# EAGLE schematic Retro_Lite_CM5_IO_X2.2 (EAGLE 9.6.1), part 1 of 2

## Sheet 1 of 2: Radxa CM5 Connectors
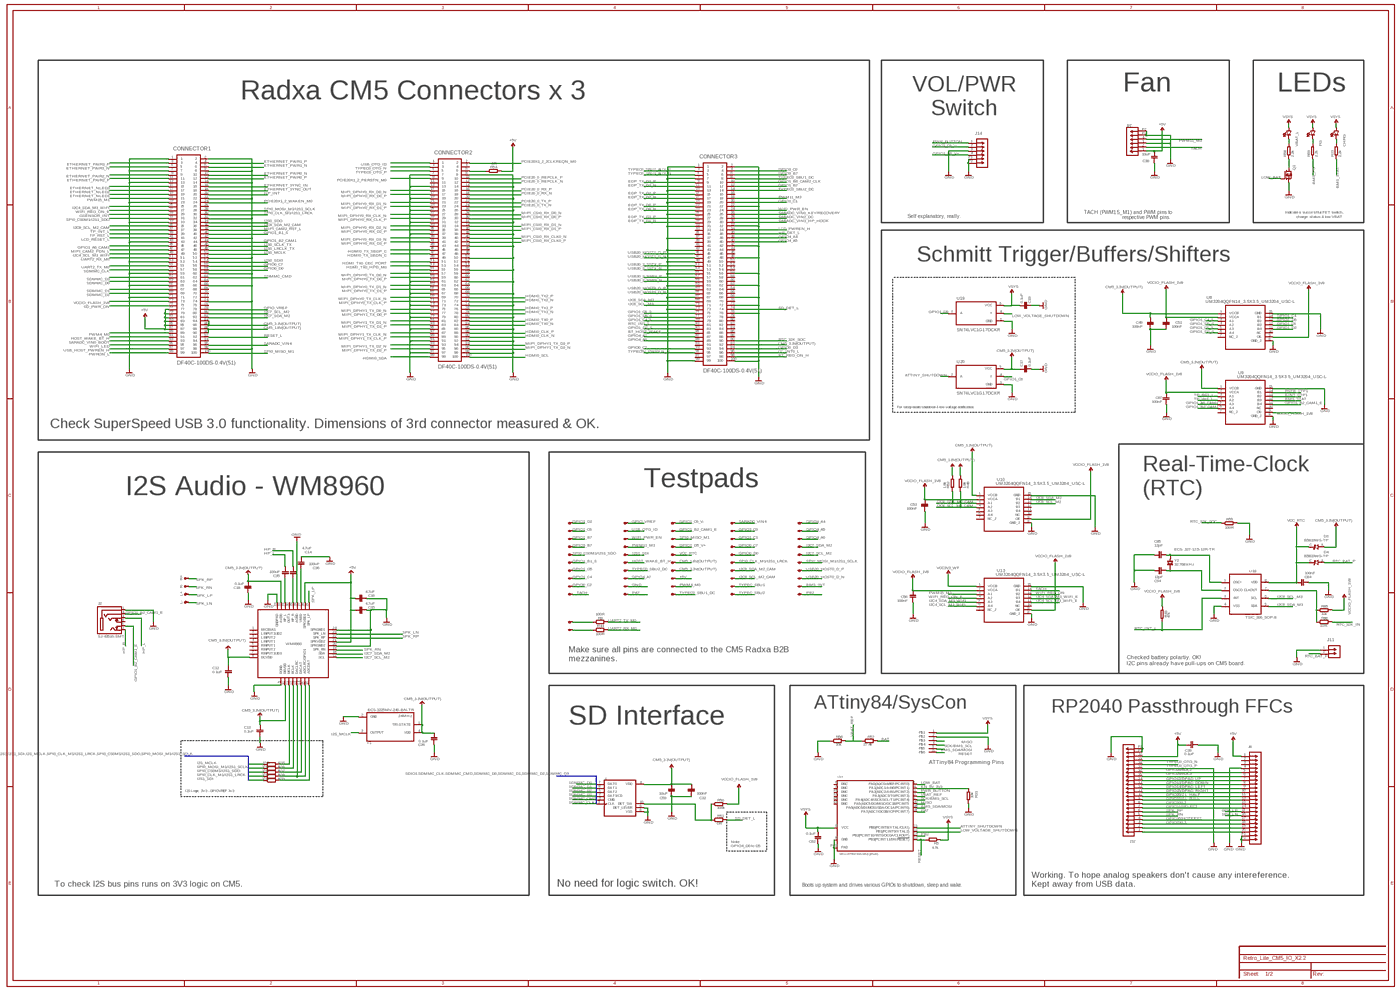
[diagram p0: schematic, sheet 1, overview]
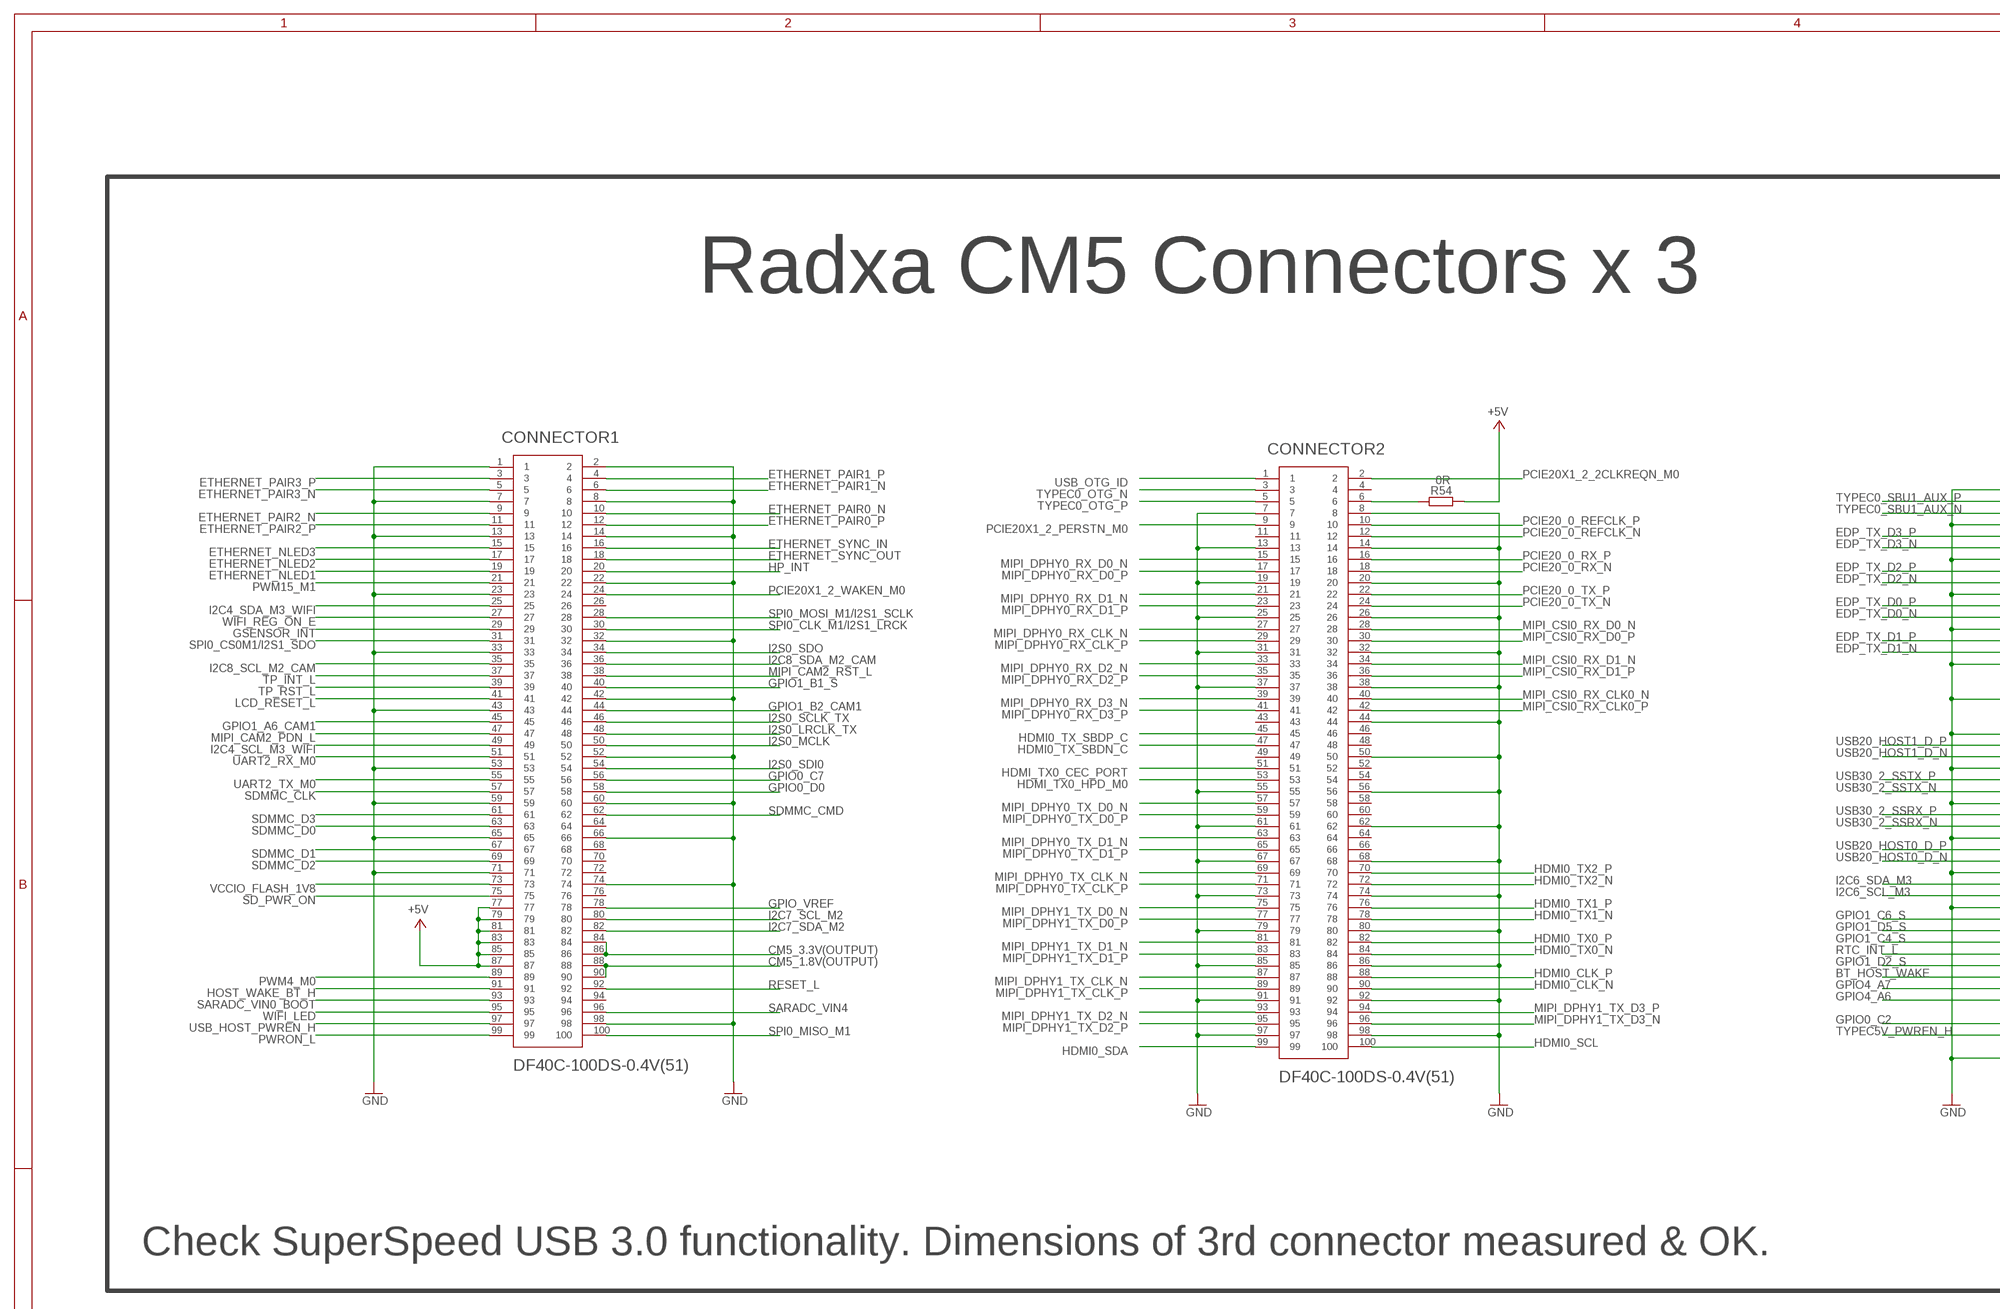
[diagram p1: schematic, sheet 1, part 1 of 4]
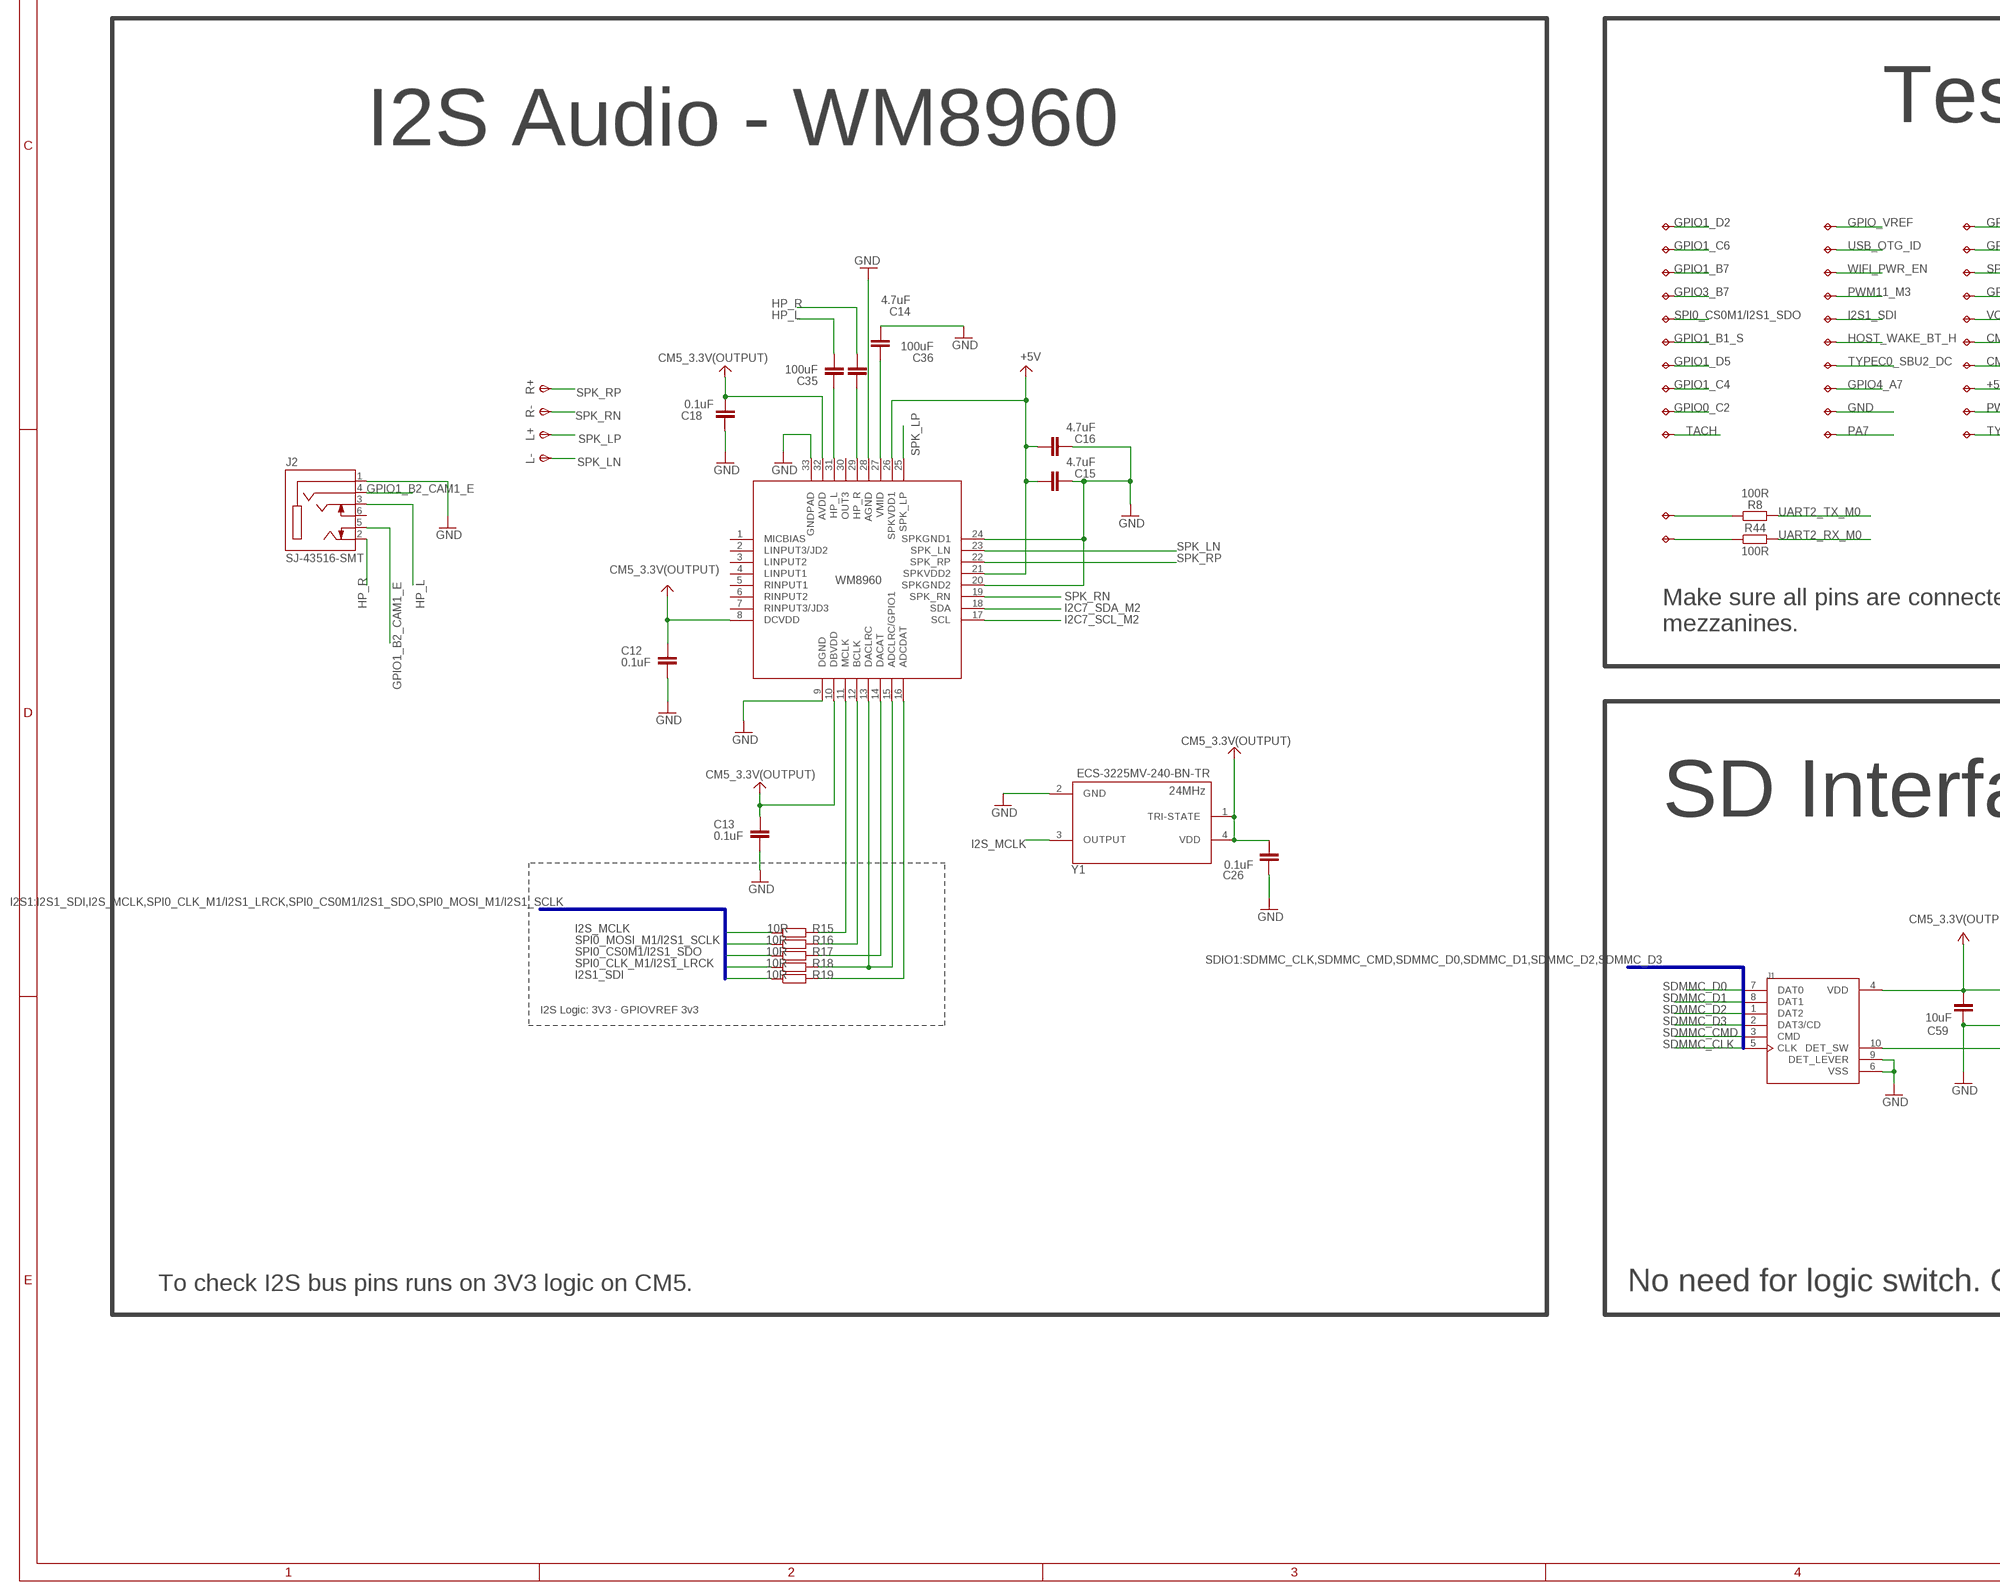
[diagram p2: schematic, sheet 1, part 2 of 4]
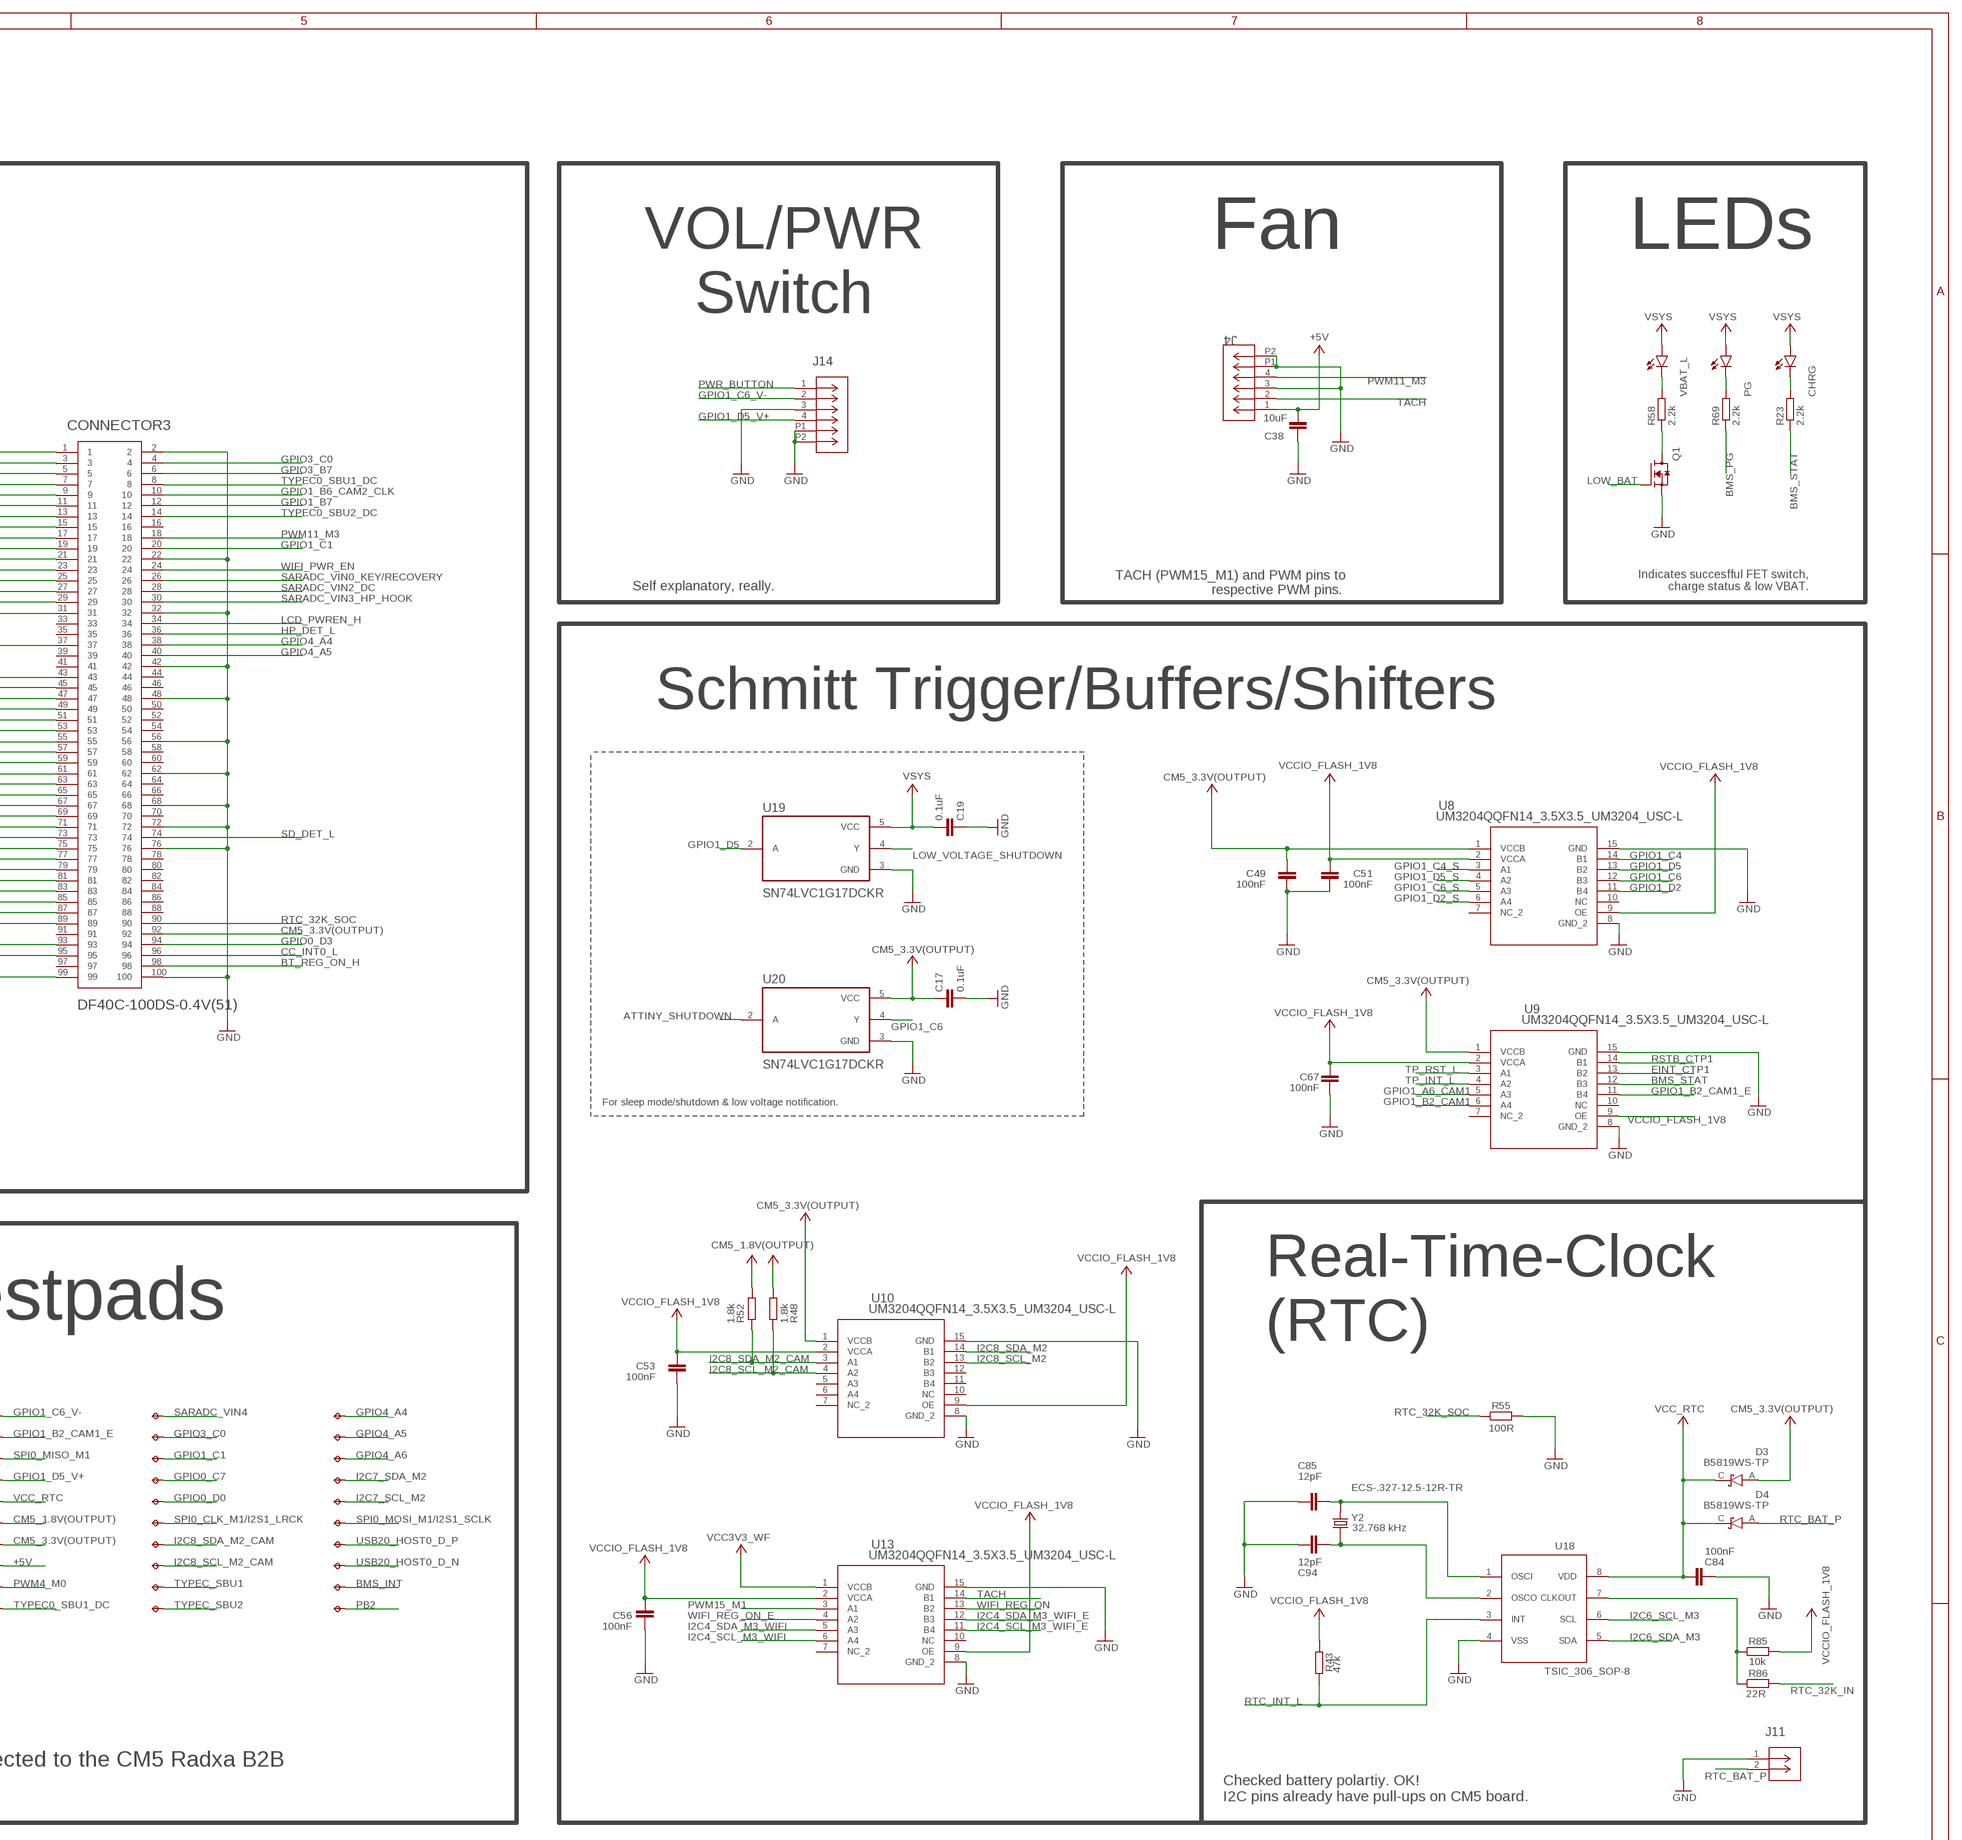
[diagram p3: schematic, sheet 1, part 3 of 4]
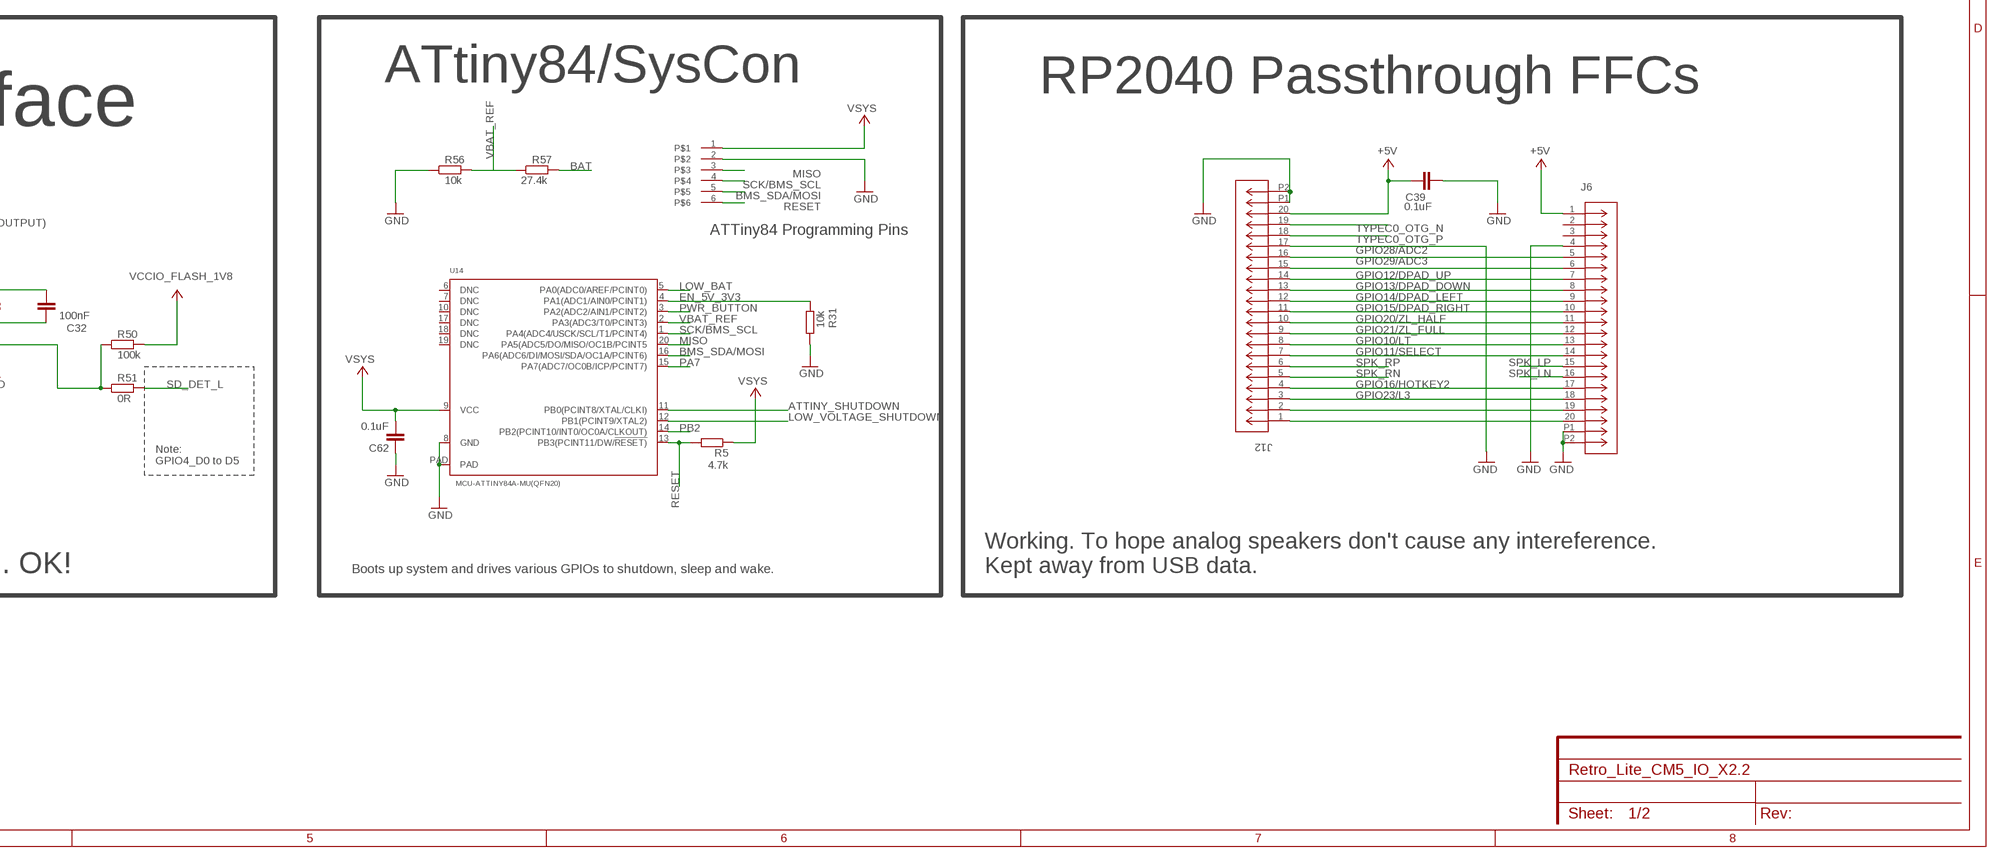
[diagram p4: schematic, sheet 1, part 4 of 4]

### Parts
1V8_SCL  TPTP07R  [TP07R]
1V8_SDA  TPTP07R  [TP07R]
3V3_SCL  TPTP07R  [TP07R]
3V3_SDA  TPTP07R  [TP07R]
+5V  TPTP07R  [TP07R]
BMS_INT  TPTP07R  [TP07R]
BT_DIS  TPTP07R  [TP07R]
C12  0.1uF  C-EUC0603  [C0603]
C13  0.1uF  C-EUC0603  [C0603]
C14  4.7uF  C-EUC0603  [C0603]
C15  4.7uF  C-EUC0603  [C0603]
C16  4.7uF  C-EUC0603  [C0603]
C17  0.1uF  C-EUC0402-YVELTAL  [C0402]
C18  0.1uF  C-EUC0603  [C0603]
C19  0.1uF  C-EUC0402-YVELTAL  [C0402]
C26  0.1uF  C-EUC0603  [C0603]
C32  100nF  C-EUC0402-YVELTAL  [C0402]
C35  100uF  C-EUC1206  [C1206]
C36  100uF  C-EUC1206  [C1206]
C38  10uF  1.0UF-0805-25V-(+80/-20%)  [0805]
C39  0.1uF  C-EUC0402-YVELTAL  [C0402]
C49  100nF  C-EUC0402-YVELTAL  [C0402]
C51  100nF  C-EUC0402-YVELTAL  [C0402]
C53  100nF  C-EUC0402-YVELTAL  [C0402]
C56  100nF  C-EUC0402-YVELTAL  [C0402]
C59  10uF  C-EUC0402-YVELTAL  [C0402]
C62  0.1uF  C-EUC0402-YVELTAL  [C0402]
C67  100nF  C-EUC0402-YVELTAL  [C0402]
C84  100nF  C-EUC0402-YVELTAL  [C0402]
C85  12pF  C-EUC0402-YVELTAL  [C0402]
C94  100nF  C-EUC0402-YVELTAL  [C0402]
CHRG  LEDSML0603  [SML0603]
CM5_1V8  TPTP07R  [TP07R]
CM5_3.3V  TPTP07R  [TP07R]
CONNECTOR1  DF40C-100DS-0.4V(51)  [HRS_DF40C-100DS-0.4V(51)]
CONNECTOR2  DF40C-100DS-0.4V(51)  [HRS_DF40C-100DS-0.4V(51)]
CONNECTOR3  DF40C-100DS-0.4V(51)  [HRS_DF40C-100DS-0.4V(51)]
D3  B5819WS-TP  [SOD2512X115N]
D4  B5819WS-TP  [SOD2512X115N]
GND  TPTP07R  [TP07R]
GPIO0_C2  TPTP07R  [TP07R]
GPIO0_C7  TPTP07R  [TP07R]
GPIO0_D0  TPTP07R  [TP07R]
GPIO1_B1  TPTP07R  [TP07R]
GPIO1_B7  TPTP07R  [TP07R]
GPIO1_C1  TPTP07R  [TP07R]
GPIO1_C4  TPTP07R  [TP07R]
GPIO1_C6  TPTP07R  [TP07R]
GPIO1_C6_V-  TPTP07R  [TP07R]
GPIO1_D2  TPTP07R  [TP07R]
GPIO1_D5  TPTP07R  [TP07R]
GPIO1_D5_V+  TPTP07R  [TP07R]
GPIO3_B7  TPTP07R  [TP07R]
GPIO3_C0  TPTP07R  [TP07R]
GPIO4_A4  TPTP07R  [TP07R]
GPIO4_A5  TPTP07R  [TP07R]
GPIO4_A6  TPTP07R  [TP07R]
GPIO4_A7  TPTP07R  [TP07R]
GPIO14_HPD  TPTP07R  [TP07R]
GPIO_VREF  TPTP07R  [TP07R]
I2S1_LRCK  TPTP07R  [TP07R]
I2S1_SCLK  TPTP07R  [TP07R]
I2S1_SDI  TPTP07R  [TP07R]
I2S1_SDO  TPTP07R  [TP07R]
J1  5025700893  [MOLEX_5025700893]
J2  SJ-43516-SMT  [CUI_SJ-43516-SMT]
J4  5051100492  [CON_5051100492_MOL]
J6  5034802000  [CON_5034802000_MOL]
J11  1072TR  [CONN_1072TR_KEY]
J12  5034802000  [CON_5034802000_MOL]
J14  5051100492  [CON_5051100492_MOL]
L+  TPSTP09SQ  [TP09SQ]
L-  TPSTP09SQ  [TP09SQ]
NEXTRST  TPTP07R  [TP07R]
PB0  TPTP07R  [TP07R]
PB1  TPTP07R  [TP07R]
PG  LEDSML0603  [SML0603]
PWM_CTRL  TPTP07R  [TP07R]
Q1  AO3400A  [SOT95P280X125-3N]
R5  4.7k  R-EU_R0402  [R0402]
R8  100R  R-EU_R0402  [R0402]
R15  10R  R-EU_R0603  [R0603]
R16  10R  R-EU_R0603  [R0603]
R17  10R  R-EU_R0603  [R0603]
R18  10R  R-EU_R0603  [R0603]
R19  10R  R-EU_R0603  [R0603]
R23  2.2k  R-EU_R0402  [R0402]
R31  10k  R-EU_R0402  [R0402]
R43  47k  R-EU_R0402  [R0402]
R44  100R  R-EU_R0402  [R0402]
R48  1.8k  R-EU_R0402  [R0402]
R50  100k  R-EU_R0402  [R0402]
R51  0R  R-EU_R0402  [R0402]
R52  1.8k  R-EU_R0402  [R0402]
R54  0R  R-EU_R0402  [R0402]
R55  100R  R-EU_R0402  [R0402]
R56  10k  R-EU_R0402  [R0402]
R57  27.4k  R-EU_R0402  [R0402]
R58  2.2k  R-EU_R0402  [R0402]
R69  2.2k  R-EU_R0402  [R0402]
R85  10k  R-EU_R0402  [R0402]
R86  22R  R-EU_R0402  [R0402]
R+  TPSTP09SQ  [TP09SQ]
R-  TPSTP09SQ  [TP09SQ]
SARADC_VIN4  TPTP07R  [TP07R]
SBU1  TPTP07R  [TP07R]
SBU1_DC  TPTP07R  [TP07R]
SBU2  TPTP07R  [TP07R]
SBU2_DC  TPTP07R  [TP07R]
TACH  TPTP07R  [TP07R]
U6  WM8960  [QFN50P500X500X100-33N]
U8  UM3204QQFN14_3.5X3.5_UM3204_USC-L  [QFN14_3.5X3.5_UM3204_USC-L]
U9  UM3204QQFN14_3.5X3.5_UM3204_USC-L  [QFN14_3.5X3.5_UM3204_USC-L]
U10  UM3204QQFN14_3.5X3.5_UM3204_USC-L  [QFN14_3.5X3.5_UM3204_USC-L]
U13  UM3204QQFN14_3.5X3.5_UM3204_USC-L  [QFN14_3.5X3.5_UM3204_USC-L]
U14  MCU-ATTINY84A-MU(QFN20)  [QFN20G-0.5-4X4MM]
U18  TSIC_306_SOP-8  [SOIC127P602X173-8N]
U19  SN74LVC1G17DCKR  [SOT65P210X110-5N]
U20  SN74LVC1G17DCKR  [SOT65P210X110-5N]
U$3  6PINEADER  [1MM_PIC-PROGRAMING_HEADER]
UART2_RX_M0  TPTP07R  [TP07R]
UART2_TX_M0  TPTP07R  [TP07R]
USB20_HOST0_N  TPTP07R  [TP07R]
USB20_HOST0_P  TPTP07R  [TP07R]
USB_OTG_ID  TPTP07R  [TP07R]
VBAT_L  LEDSML0603  [SML0603]
VCC_RTC  TPTP07R  [TP07R]
WIFI_PWR_EN  TPTP07R  [TP07R]
WL_DIS/PWM4_M0  TPTP07R  [TP07R]
Y1  ECS-3225MV-240-BN-TR  [OSC_ECS-2333-160-BN-TR]
Y2  ECS-.327-12.5-12R-TR  [XTAL_ECS-.327-12.5-12R-TR]

### Nets
3V3: J6.19 J12.2
+5V: +5V.TP C15.1 C16.1 C38.2 C39.1 CONNECTOR1.77 CONNECTOR1.79 CONNECTOR1.81 CONNECTOR1.83 CONNECTOR1.85 CONNECTOR1.87 J4.1 J6.1 J12.20 R54.2 U6.21(SPKVDD2) U6.26(SPKVDD1) ; supply symbol labelled VDD, VSYS, VCC ; also sheet 2
ADC: R19.2 U6.16(ADCDAT)
ATTINY_SHUTDOWN: U14.11(PB0(PCINT8/XTAL/CLKI)) U20.2(A)
BAT: R57.2 ; also sheet 2
BCLK: R16.2 U6.12(BCLK)
BMS_INT: BMS_INT.TP ; also sheet 2
BMS_PG: R69.1
BMS_SDA/MOSI: U14.16(PA6(ADC6/DI/MOSI/SDA/OC1A/PCINT6)) U$3.5 ; also sheet 2
BMS_STAT: R23.1 U9.12(B3) ; also sheet 2
BT_HOST_WAKE: CONNECTOR3.85 ; also sheet 2
BT_REG_ON_H: CONNECTOR3.98 ; also sheet 2
CC_INT0_L: CONNECTOR3.96
CM5_1.8V(OUTPUT): CM5_1V8.TP CONNECTOR1.88 CONNECTOR1.90 R48.2 R52.2 ; supply symbol labelled VSYS ; also sheet 2
CM5_3.3V(OUTPUT): C12.1 C13.1 C17.1 C18.2 C26.2 C32.2 C49.2 C59.2 CM5_3.3V.TP CONNECTOR1.84 CONNECTOR1.86 CONNECTOR3.92 D3.A J1.4(VDD) U6.8(DCVDD) U6.10(DBVDD) U6.32(AVDD) U8.1(VCCB) U9.1(VCCB) U10.1(VCCB) U20.5(VCC) Y1.1(TRI-STATE) Y1.4(VDD) ; supply symbol labelled VSYS, VDD, VCC ; also sheet 2
DAC: R17.2 U6.14(DACAT)
EDP_TX_D0_N [eDP 1st Layer]: CONNECTOR3.23 ; also sheet 2
EDP_TX_D0_P [eDP 1st Layer]: CONNECTOR3.21 ; also sheet 2
EDP_TX_D1_N [eDP 1st Layer]: CONNECTOR3.29 ; also sheet 2
EDP_TX_D1_P [eDP 1st Layer]: CONNECTOR3.27 ; also sheet 2
EDP_TX_D2_N [eDP 1st Layer]: CONNECTOR3.17 ; also sheet 2
EDP_TX_D2_P [eDP 1st Layer]: CONNECTOR3.15 ; also sheet 2
EDP_TX_D3_N [eDP 1st Layer]: CONNECTOR3.11 ; also sheet 2
EDP_TX_D3_P [eDP 1st Layer]: CONNECTOR3.9 ; also sheet 2
EINT_CTP1: U9.13(B2) ; also sheet 2
EN_5V_3V3: R31.2 U14.4(PA1(ADC1/AIN0/PCINT1)) ; also sheet 2
ETHERNET_NLED1: CONNECTOR1.19
ETHERNET_NLED2: CONNECTOR1.17
ETHERNET_NLED3: CONNECTOR1.15
ETHERNET_PAIR0_N: CONNECTOR1.10
ETHERNET_PAIR0_P: CONNECTOR1.12
ETHERNET_PAIR1_N: CONNECTOR1.6
ETHERNET_PAIR1_P: CONNECTOR1.4
ETHERNET_PAIR2_N: CONNECTOR1.9
ETHERNET_PAIR2_P: CONNECTOR1.11
ETHERNET_PAIR3_N: CONNECTOR1.5
ETHERNET_PAIR3_P: CONNECTOR1.3
ETHERNET_SYNC_IN: CONNECTOR1.16
ETHERNET_SYNC_OUT: CONNECTOR1.18
GND: C12.2 C13.2 C14.2 C15.2 C16.2 C17.2 C18.1 C19.1 C26.1 C32.1 C38.1 C39.2 C49.1 C51.1 C53.1 C56.1 C59.1 C62.1 C67.1 C84.1 C85.2 C94.2 CONNECTOR1.1 CONNECTOR1.2 CONNECTOR1.7 CONNECTOR1.8 CONNECTOR1.13 CONNECTOR1.14 CONNECTOR1.22 CONNECTOR1.23 CONNECTOR1.32 CONNECTOR1.33 CONNECTOR1.42 CONNECTOR1.43 CONNECTOR1.52 CONNECTOR1.53 CONNECTOR1.59 CONNECTOR1.60 CONNECTOR1.65 CONNECTOR1.66 CONNECTOR1.71 CONNECTOR1.74 CONNECTOR1.98 CONNECTOR2.7 CONNECTOR2.8 CONNECTOR2.13 CONNECTOR2.14 CONNECTOR2.19 CONNECTOR2.20 CONNECTOR2.25 CONNECTOR2.26 CONNECTOR2.31 CONNECTOR2.32 CONNECTOR2.37 CONNECTOR2.38 CONNECTOR2.44 CONNECTOR2.50 CONNECTOR2.55 CONNECTOR2.56 CONNECTOR2.61 CONNECTOR2.62 CONNECTOR2.67 CONNECTOR2.68 CONNECTOR2.73 CONNECTOR2.74 CONNECTOR2.79 CONNECTOR2.80 CONNECTOR2.85 CONNECTOR2.86 CONNECTOR2.91 CONNECTOR2.92 CONNECTOR2.97 CONNECTOR2.98 CONNECTOR3.1 CONNECTOR3.2 CONNECTOR3.7 CONNECTOR3.13 CONNECTOR3.19 CONNECTOR3.22 CONNECTOR3.25 CONNECTOR3.31 CONNECTOR3.32 CONNECTOR3.37 CONNECTOR3.42 CONNECTOR3.43 CONNECTOR3.48 CONNECTOR3.49 CONNECTOR3.55 CONNECTOR3.56 CONNECTOR3.61 CONNECTOR3.62 CONNECTOR3.67 CONNECTOR3.68 CONNECTOR3.72 CONNECTOR3.73 CONNECTOR3.76 CONNECTOR3.99 CONNECTOR3.100 GND.TP J1.6(VSS) J1.9(DET_LEVER) J2.1(SLEEVE) J4.3 J4.P1 J4.P2 J6.4 J6.P1 J6.P2 J11.1 J12.17 J12.P1 J12.P2 J14.3 J14.P1 J14.P2 Q1.2(S) R31.1 R55.2 R56.1 U6.9(DGND) U6.20(SPKGND2) U6.24(SPKGND1) U6.28(AGND) U6.33(GNDPAD) U8.8(GND_2) U8.15(GND) U9.8(GND_2) U9.15(GND) U10.8(GND_2) U10.15(GND) U13.8(GND_2) U13.15(GND) U14.8(GND) U14.PAD U18.4(VSS) U19.3(GND) U20.3(GND) U$3.2 Y1.2(GND) ; also sheet 2
GPIO0_C2: CONNECTOR3.93 GPIO0_C2.TP
GPIO0_C7: CONNECTOR1.56 GPIO0_C7.TP ; also sheet 2
GPIO0_D0: CONNECTOR1.58 GPIO0_D0.TP
GPIO0_D3: CONNECTOR3.94 ; also sheet 2
GPIO1_A6_CAM1: CONNECTOR1.45 U9.5(A3)
GPIO1_B1_S: CONNECTOR1.40 GPIO1_B1.TP
GPIO1_B2_CAM1: CONNECTOR1.44 U9.6(A4)
GPIO1_B2_CAM1_E: GPIO14_HPD.TP J2.4(RING2) J2.5(TIP_SWITCH) U9.11(B4)
GPIO1_B6_CAM2_CLK: CONNECTOR3.10
GPIO1_B7: CONNECTOR3.12 GPIO1_B7.TP
GPIO1_C1: CONNECTOR3.20 GPIO1_C1.TP
GPIO1_C4: GPIO1_C4.TP U8.14(B1) ; also sheet 2
GPIO1_C4_S: CONNECTOR3.79 U8.3(A1)
GPIO1_C6: GPIO1_C6.TP U8.12(B3) U20.4(Y)
GPIO1_C6_S: CONNECTOR3.75 U8.5(A3)
GPIO1_C6_V-: GPIO1_C6_V-.TP J14.2
GPIO1_D2: GPIO1_D2.TP U8.11(B4) ; also sheet 2
GPIO1_D2_S: CONNECTOR3.83 U8.6(A4)
GPIO1_D5: GPIO1_D5.TP U8.13(B2) U19.2(A)
GPIO1_D5_S: CONNECTOR3.77 U8.4(A2)
GPIO1_D5_V+: GPIO1_D5_V+.TP J14.4
GPIO3_B7: CONNECTOR3.6 GPIO3_B7.TP
GPIO3_C0: CONNECTOR3.4 GPIO3_C0.TP
GPIO4_A4: CONNECTOR3.38 GPIO4_A4.TP
GPIO4_A5: CONNECTOR3.40 GPIO4_A5.TP
GPIO4_A6: CONNECTOR3.89 GPIO4_A6.TP
GPIO4_A7: CONNECTOR3.87 GPIO4_A7.TP
GPIO10/LT: J6.13 J12.8
GPIO11/SELECT: J6.14 J12.7
GPIO12/DPAD_UP: J6.7 J12.14
GPIO13/DPAD_DOWN: J6.8 J12.13
GPIO14/DPAD_LEFT: J6.9 J12.12
GPIO15/DPAD_RIGHT: J6.10 J12.11
GPIO16/HOTKEY2: J6.17 J12.4
GPIO20/ZL_HALF: J6.11 J12.10
GPIO21/ZL_FULL: J6.12 J12.9
GPIO23/L3: J6.18 J12.3
GPIO28/ADC2: J6.5 J12.16
GPIO29/ADC3: J6.6 J12.15
GPIO_VREF: CONNECTOR1.78 GPIO_VREF.TP
GSENSOR_INT: CONNECTOR1.29 ; also sheet 2
HDMI0_CLK_N [HDMI 4th Layer]: CONNECTOR2.90 ; also sheet 2
HDMI0_CLK_P [HDMI 4th Layer]: CONNECTOR2.88 ; also sheet 2
HDMI0_SCL: CONNECTOR2.100 ; also sheet 2
HDMI0_SDA: CONNECTOR2.99 ; also sheet 2
HDMI0_TX0_N [HDMI 4th Layer]: CONNECTOR2.84 ; also sheet 2
HDMI0_TX0_P [HDMI 4th Layer]: CONNECTOR2.82 ; also sheet 2
HDMI0_TX1_N [HDMI 4th Layer]: CONNECTOR2.78 ; also sheet 2
HDMI0_TX1_P [HDMI 4th Layer]: CONNECTOR2.76 ; also sheet 2
HDMI0_TX2_N [HDMI 4th Layer]: CONNECTOR2.72 ; also sheet 2
HDMI0_TX2_P [HDMI 4th Layer]: CONNECTOR2.70 ; also sheet 2
HDMI0_TX_SBDN_C: CONNECTOR2.47 ; also sheet 2
HDMI0_TX_SBDP_C: CONNECTOR2.45 ; also sheet 2
HDMI_TX0_CEC_PORT: CONNECTOR2.51 ; also sheet 2
HDMI_TX0_HPD_M0: CONNECTOR2.53 ; also sheet 2
HOST_WAKE_BT_H: BT_DIS.TP CONNECTOR1.91 ; also sheet 2
HP_DET_L: CONNECTOR3.36
HP_INT: CONNECTOR1.20
HP_L: C35.2 J2.3(RING1)
HP_R: C36.2 J2.2(TIP)
I2C4_SCL_M3_WIFI: CONNECTOR1.49 U13.6(A4)
I2C4_SCL_M3_WIFI_E: U13.11(B4) ; also sheet 2
I2C4_SDA_M3_WIFI: CONNECTOR1.25 U13.5(A3)
I2C4_SDA_M3_WIFI_E: U13.12(B3) ; also sheet 2
I2C6_SCL_M3: CONNECTOR3.71 U18.6(SCL)
I2C6_SDA_M3: CONNECTOR3.69 U18.5(SDA)
I2C7_SCL_M2: 3V3_SCL.TP CONNECTOR1.80 U6.17(SCL) ; also sheet 2
I2C7_SDA_M2: 3V3_SDA.TP CONNECTOR1.82 U6.18(SDA) ; also sheet 2
I2C8_SCL_M2: U10.13(B2) ; also sheet 2
I2C8_SCL_M2_CAM: 1V8_SCL.TP CONNECTOR1.35 R48.1 U10.4(A2)
I2C8_SDA_M2: U10.14(B1) ; also sheet 2
I2C8_SDA_M2_CAM: 1V8_SDA.TP CONNECTOR1.36 R52.1 U10.3(A1)
I2S0_LRCLK_TX: CONNECTOR1.48
I2S0_MCLK: CONNECTOR1.50
I2S0_SCLK_TX: CONNECTOR1.46
I2S0_SDI0: CONNECTOR1.54
I2S0_SDO: CONNECTOR1.34
I2S1_SDI: I2S1_SDI.TP R19.1
I2S_MCLK: R15.1 Y1.3(OUTPUT)
LCD_PWREN_H: CONNECTOR3.34
LCD_RESET_L: CONNECTOR1.41 ; also sheet 2
LOW_BAT: Q1.1(G) U14.5(PA0(ADC0/AREF/PCINT0))
LOW_VOLTAGE_SHUTDOWN: U14.12(PB1(PCINT9/XTAL2)) U19.4(Y)
MCLK: R15.2 U6.11(MCLK)
MIPI_CAM2_PDN_L: CONNECTOR1.47
MIPI_CAM2_RST_L [MIPI]: CONNECTOR1.38
MIPI_CSI0_RX_CLK0_N [MIPI]: CONNECTOR2.40
MIPI_CSI0_RX_CLK0_P [MIPI]: CONNECTOR2.42
MIPI_CSI0_RX_D0_N [MIPI]: CONNECTOR2.28
MIPI_CSI0_RX_D0_P [MIPI]: CONNECTOR2.30
MIPI_CSI0_RX_D1_N [MIPI]: CONNECTOR2.34
MIPI_CSI0_RX_D1_P [MIPI]: CONNECTOR2.36
MIPI_DPHY0_RX_CLK_N: CONNECTOR2.27
MIPI_DPHY0_RX_CLK_P: CONNECTOR2.29
MIPI_DPHY0_RX_D0_N: CONNECTOR2.15
MIPI_DPHY0_RX_D0_P: CONNECTOR2.17
MIPI_DPHY0_RX_D1_N: CONNECTOR2.21
MIPI_DPHY0_RX_D1_P: CONNECTOR2.23
MIPI_DPHY0_RX_D2_N: CONNECTOR2.33
MIPI_DPHY0_RX_D2_P: CONNECTOR2.35
MIPI_DPHY0_RX_D3_N: CONNECTOR2.39
MIPI_DPHY0_RX_D3_P: CONNECTOR2.41
MIPI_DPHY0_TX_CLK_N [MIPI]: CONNECTOR2.69
MIPI_DPHY0_TX_CLK_P [MIPI]: CONNECTOR2.71
MIPI_DPHY0_TX_D0_N: CONNECTOR2.57
MIPI_DPHY0_TX_D0_P [MIPI]: CONNECTOR2.59
MIPI_DPHY0_TX_D1_N [MIPI]: CONNECTOR2.63
MIPI_DPHY0_TX_D1_P [MIPI]: CONNECTOR2.65
MIPI_DPHY1_TX_CLK_N [MIPI]: CONNECTOR2.87 ; also sheet 2
MIPI_DPHY1_TX_CLK_P [MIPI]: CONNECTOR2.89 ; also sheet 2
MIPI_DPHY1_TX_D0_N [MIPI]: CONNECTOR2.75 ; also sheet 2
MIPI_DPHY1_TX_D0_P [MIPI]: CONNECTOR2.77 ; also sheet 2
MIPI_DPHY1_TX_D1_N [MIPI]: CONNECTOR2.81 ; also sheet 2
MIPI_DPHY1_TX_D1_P [MIPI]: CONNECTOR2.83 ; also sheet 2
MIPI_DPHY1_TX_D2_N [MIPI]: CONNECTOR2.93 ; also sheet 2
MIPI_DPHY1_TX_D2_P [MIPI]: CONNECTOR2.95 ; also sheet 2
MIPI_DPHY1_TX_D3_N [MIPI]: CONNECTOR2.96 ; also sheet 2
MIPI_DPHY1_TX_D3_P [MIPI]: CONNECTOR2.94 ; also sheet 2
MISO: U14.20(PA5(ADC5/DO/MISO/OC1B/PCINT5) U$3.3
N$10: C14.1 U6.27(VMID)
N$35: C35.1 U6.31(HP_L)
N$39: C36.1 U6.29(HP_R)
N$42: J6.20 J12.1
N$43: J1.10(DET_SW) R50.1 R51.1
N$44: R8.1 UART2_TX_M0.TP
N$49: R44.1 UART2_RX_M0.TP
N$51: CONNECTOR2.6 R54.1
N$54: R58.2 VBAT_L.C
N$59: R85.1 R86.1 U18.7(CLKOUT)
N$60: Q1.3(D) R58.1
N$61: CHRG.C R23.2
N$64: C94.1 U18.2(OSCO) Y2.1
N$65: C85.1 U18.1(OSCI) Y2.2
N$66: PG.C R69.2
PA7: PB1.TP U14.15(PA7(ADC7/OC0B/ICP/PCINT7))
PB2: PB0.TP U14.14(PB2(PCINT10/INT0/OC0A/CLKOUT))
PCIE20_0_REFCLK_N [PCIE2.0]: CONNECTOR2.12 ; also sheet 2
PCIE20_0_REFCLK_P [PCIE2.0]: CONNECTOR2.10 ; also sheet 2
PCIE20_0_RX_N [PCIE2.0]: CONNECTOR2.18 ; also sheet 2
PCIE20_0_RX_P [PCIE2.0]: CONNECTOR2.16 ; also sheet 2
PCIE20_0_TX_N [PCIE2.0]: CONNECTOR2.24 ; also sheet 2
PCIE20_0_TX_P [PCIE2.0]: CONNECTOR2.22 ; also sheet 2
PCIE20X1_2_2CLKREQN_M0: CONNECTOR2.2 ; also sheet 2
PCIE20X1_2_PERSTN_M0: CONNECTOR2.9 ; also sheet 2
PCIE20X1_2_WAKEN_M0: CONNECTOR1.24 ; also sheet 2
PWM4_M0: CONNECTOR1.89 WL_DIS/PWM4_M0.TP
PWM11_M3: CONNECTOR3.18 J4.4 PWM_CTRL.TP
PWM15_M1: CONNECTOR1.21 U13.3(A1)
PWR_BUTTON: J14.1 U14.3(PA2(ADC2/AIN1/PCINT2))
PWRON_L: CONNECTOR1.99
RESET: R5.2 U14.13(PB3(PCINT11/DW/!RESET)) U$3.6
RESET_L: CONNECTOR1.92
RSTB_CTP1: U9.14(B1) ; also sheet 2
RTC_32K_IN: R86.2 ; also sheet 2
RTC_32K_SOC: CONNECTOR3.90 R55.1
RTC_BAT_P: D4.A J11.2
RTC_INT_L: CONNECTOR3.81 R43.2 U18.3(INT)
SARADC_VIN0_BOOT: CONNECTOR1.93
SARADC_VIN0_KEY/RECOVERY: CONNECTOR3.26
SARADC_VIN2_DC: CONNECTOR3.28
SARADC_VIN3_HP_HOOK: CONNECTOR3.30
SARADC_VIN4: CONNECTOR1.96 SARADC_VIN4.TP
SCK/BMS_SCL: U14.1(PA4(ADC4/USCK/SCL/T1/PCINT4)) U$3.4 ; also sheet 2
SD_DET_L: CONNECTOR3.74 R51.2
SD_PWR_ON [eMMC HS400]: CONNECTOR1.75 ; also sheet 2
SDMMC_CLK [eMMC HS400]: CONNECTOR1.57 J1.5(CLK)
SDMMC_CMD [eMMC HS400]: CONNECTOR1.62 J1.3(CMD)
SDMMC_D0 [eMMC HS400]: CONNECTOR1.63 J1.7(DAT0)
SDMMC_D1 [eMMC HS400]: CONNECTOR1.67 J1.8(DAT1)
SDMMC_D2 [eMMC HS400]: CONNECTOR1.69 J1.1(DAT2)
SDMMC_D3 [eMMC HS400]: CONNECTOR1.61 J1.2(DAT3/CD)
SPI0_CLK_M1/I2S1_LRCK: CONNECTOR1.30 I2S1_LRCK.TP R18.1
SPI0_CS0M1/I2S1_SDO: CONNECTOR1.31 I2S1_SDO.TP R17.1
SPI0_MISO_M1: CONNECTOR1.100 NEXTRST.TP
SPI0_MOSI_M1/I2S1_SCLK: CONNECTOR1.28 I2S1_SCLK.TP R16.1
SPK_LN: J6.16 L-.TP(PP) U6.23(SPK_LN)
SPK_LP: J6.15 L+.TP(PP) U6.25(SPK_LP)
SPK_RN: J12.5 R-.TP(PP) U6.19(SPK_RN)
SPK_RP: J12.6 R+.TP(PP) U6.22(SPK_RP)
TACH: J4.2 TACH.TP U13.14(B1)
TP_INT_L: CONNECTOR1.37 U9.4(A2)
TP_RST_L: CONNECTOR1.39 U9.3(A1)
TYPEC0_OTG_N [USB2.0]: CONNECTOR2.3 J12.19
TYPEC0_OTG_P [USB2.0]: CONNECTOR2.5 J12.18
TYPEC0_SBU1_AUX_N: CONNECTOR3.5 ; also sheet 2
TYPEC0_SBU1_AUX_P: CONNECTOR3.3 ; also sheet 2
TYPEC0_SBU1_DC: CONNECTOR3.8 SBU1_DC.TP
TYPEC0_SBU2_DC: CONNECTOR3.14 SBU2_DC.TP
TYPEC5V_PWREN_H: CONNECTOR3.95
TYPEC_SBU1: SBU1.TP ; also sheet 2
TYPEC_SBU2: SBU2.TP ; also sheet 2
UART2_RX_M0: CONNECTOR1.51 R44.2
UART2_TX_M0: CONNECTOR1.55 R8.2
USB20_HOST0_D_N [USB2.0 4th Layer]: CONNECTOR3.65 USB20_HOST0_N.TP ; also sheet 2
USB20_HOST0_D_P [USB2.0 4th Layer]: CONNECTOR3.63 USB20_HOST0_P.TP ; also sheet 2
USB20_HOST1_D_N [USB2.0]: CONNECTOR3.47 ; also sheet 2
USB20_HOST1_D_P [USB2.0]: CONNECTOR3.45 ; also sheet 2
USB30_2_SSRX_N [USB3.0]: CONNECTOR3.59 ; also sheet 2
USB30_2_SSRX_P [USB3.0]: CONNECTOR3.57 ; also sheet 2
USB30_2_SSTX_N [USB3.0]: CONNECTOR3.53 ; also sheet 2
USB30_2_SSTX_P [USB3.0]: CONNECTOR3.51 ; also sheet 2
USB_HOST_PWREN_H [USB2.0]: CONNECTOR1.97
USB_OTG_ID [USB2.0]: CONNECTOR2.1 USB_OTG_ID.TP
VBAT_REF: R56.2 R57.1 U14.2(PA3(ADC3/T0/PCINT3))
VCC3V3_WF: U13.1(VCCB) ; supply symbol labelled VSYS ; also sheet 2
VCC_RTC: C84.2 D3.C(K) D4.C(K) U18.8(VDD) VCC_RTC.TP ; supply symbol labelled VCC
VCCIO_FLASH_1V8: C51.2 C53.2 C56.2 C67.2 CONNECTOR1.73 R43.1 R50.2 R85.2 U8.2(VCCA) U8.9(OE) U9.2(VCCA) U9.9(OE) U10.2(VCCA) U10.9(OE) U13.2(VCCA) U13.9(OE) ; supply symbol labelled VSYS, VCC
VSYS: C19.2 C62.2 CHRG.A PG.A R5.1 U14.9(VCC) U19.5(VCC) U$3.1 VBAT_L.A ; also sheet 2
WIFI_LED: CONNECTOR1.95 ; also sheet 2
WIFI_PWR_EN: CONNECTOR3.24 WIFI_PWR_EN.TP ; also sheet 2
WIFI_REG_ON: U13.13(B2) ; also sheet 2
WIFI_REG_ON_E: CONNECTOR1.27 U13.4(A2)
WS: R18.2 U6.13(DACLRC) U6.15(ADCLRC/GPIO1)
Unconnected: CONNECTOR1.26 CONNECTOR1.64 CONNECTOR1.68 CONNECTOR1.70 CONNECTOR1.72 CONNECTOR1.76 CONNECTOR1.94 CONNECTOR2.4 CONNECTOR2.11 CONNECTOR2.43 CONNECTOR2.46 CONNECTOR2.48 CONNECTOR2.49 CONNECTOR2.52 CONNECTOR2.54 CONNECTOR2.58 CONNECTOR2.60 CONNECTOR2.64 CONNECTOR2.66 CONNECTOR3.16 CONNECTOR3.33 CONNECTOR3.35 CONNECTOR3.39 CONNECTOR3.41 CONNECTOR3.44 CONNECTOR3.46 CONNECTOR3.50 CONNECTOR3.52 CONNECTOR3.54 CONNECTOR3.58 CONNECTOR3.60 CONNECTOR3.64 CONNECTOR3.66 CONNECTOR3.70 CONNECTOR3.78 CONNECTOR3.80 CONNECTOR3.82 CONNECTOR3.84 CONNECTOR3.86 CONNECTOR3.88 CONNECTOR3.91 CONNECTOR3.97 J2.6(RING_SWITCH) J6.2 J6.3 U6.1(MICBIAS) U6.2(LINPUT3/JD2) U6.3(LINPUT2) U6.4(LINPUT1) U6.5(RINPUT1) U6.6(RINPUT2) U6.7(RINPUT3/JD3) U6.30(OUT3) U8.7(NC_2) U8.10(NC) U9.7(NC_2) U9.10(NC) U10.5(A3) U10.6(A4) U10.7(NC_2) U10.10(NC) U10.11(B4) U10.12(B3) U13.7(NC_2) U13.10(NC) U14.6(DNC) U14.7(DNC) U14.10(DNC) U14.17(DNC) U14.18(DNC) U14.19(DNC)

### Buses
I2S1:I2S1_SDI,I2S_MCLK,SPI0_CLK_M1/I2S1_LRCK,SPI0_CS0M1/I2S1_SDO,SPI0_MOSI_M1/I2S1_SCLK
SDIO1:SDMMC_CLK,SDMMC_CMD,SDMMC_D0,SDMMC_D1,SDMMC_D2,SDMMC_D3

### Notes on the sheet
- VOL/PWR | Fan | LEDs
- Radxa CM5 Connectors x 3
- Switch
- 0R
- TACH (PWM15_M1) and PWM pins to
  respective PWM pins.
- Indicates succesfful FET switch, 
  charge status & low VBAT.
- Self explanatory, really.
- Schmitt Trigger/Buffers/Shifters
- 100nF | 100nF
- 100nF
- For sleep mode/shutdown & low voltage notification.
- Check SuperSpeed USB 3.0 functionality. Dimensions of 3rd connector measured & OK.
- Testpads
- I2S Audio - WM8960
- Real-Time-Clock
  (RTC)
- 100nF
- 100R
- 12pF
- 32.768 kHz
- 100nF
- 12pF
- 100nF
- 10k
- 100R
- 47k
- 22R
- 100R
- WM8960
- Make sure all pins are connected to the CM5 Radxa B2B 
  mezzanines.
- Checked battery polartiy. OK!
  I2C pins already have pull-ups on CM5 board.
- ATtiny84/SysCon | RP2040 Passthrough FFCs
- 24MHz
- SD Interface
- 0.1uF
- 0.1uF
- ATTiny84 Programming Pins
- I2S Logic: 3V3 - GPIOVREF 3v3 | 10uF | 100nF
- Note:
  GPIO4_D0 to D5
- To check I2S bus pins runs on 3V3 logic on CM5. | No need for logic switch. OK! | Boots up system and drives various GPIOs to shutdown, sleep and wake.
- Working. To hope analog speakers don't cause any intereference. 
  Kept away from USB data.

## Sheet 2 of 2: Peripherals
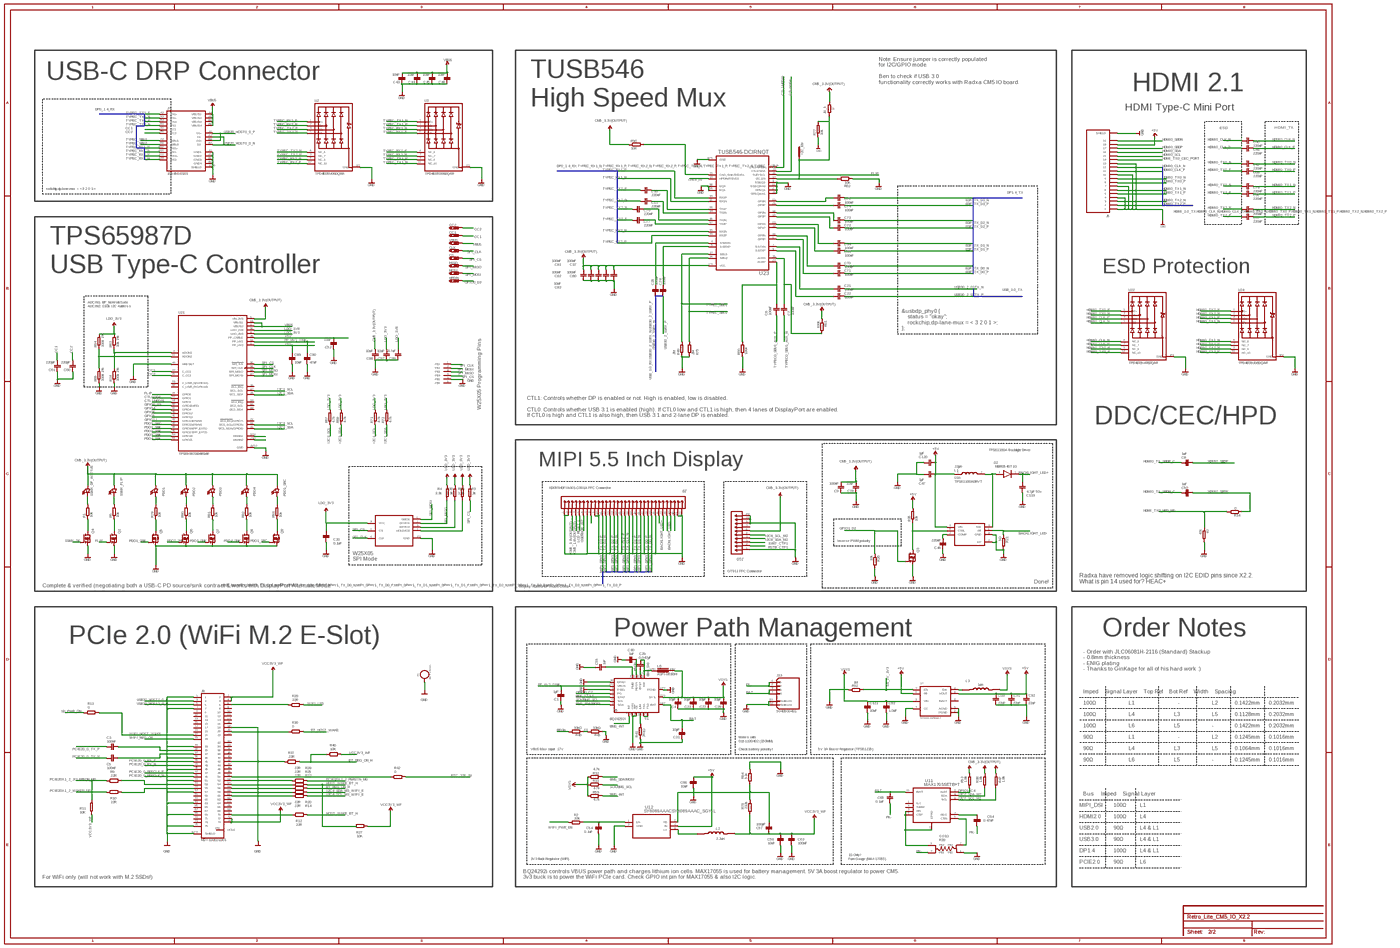
[diagram p5: schematic, sheet 2, overview]
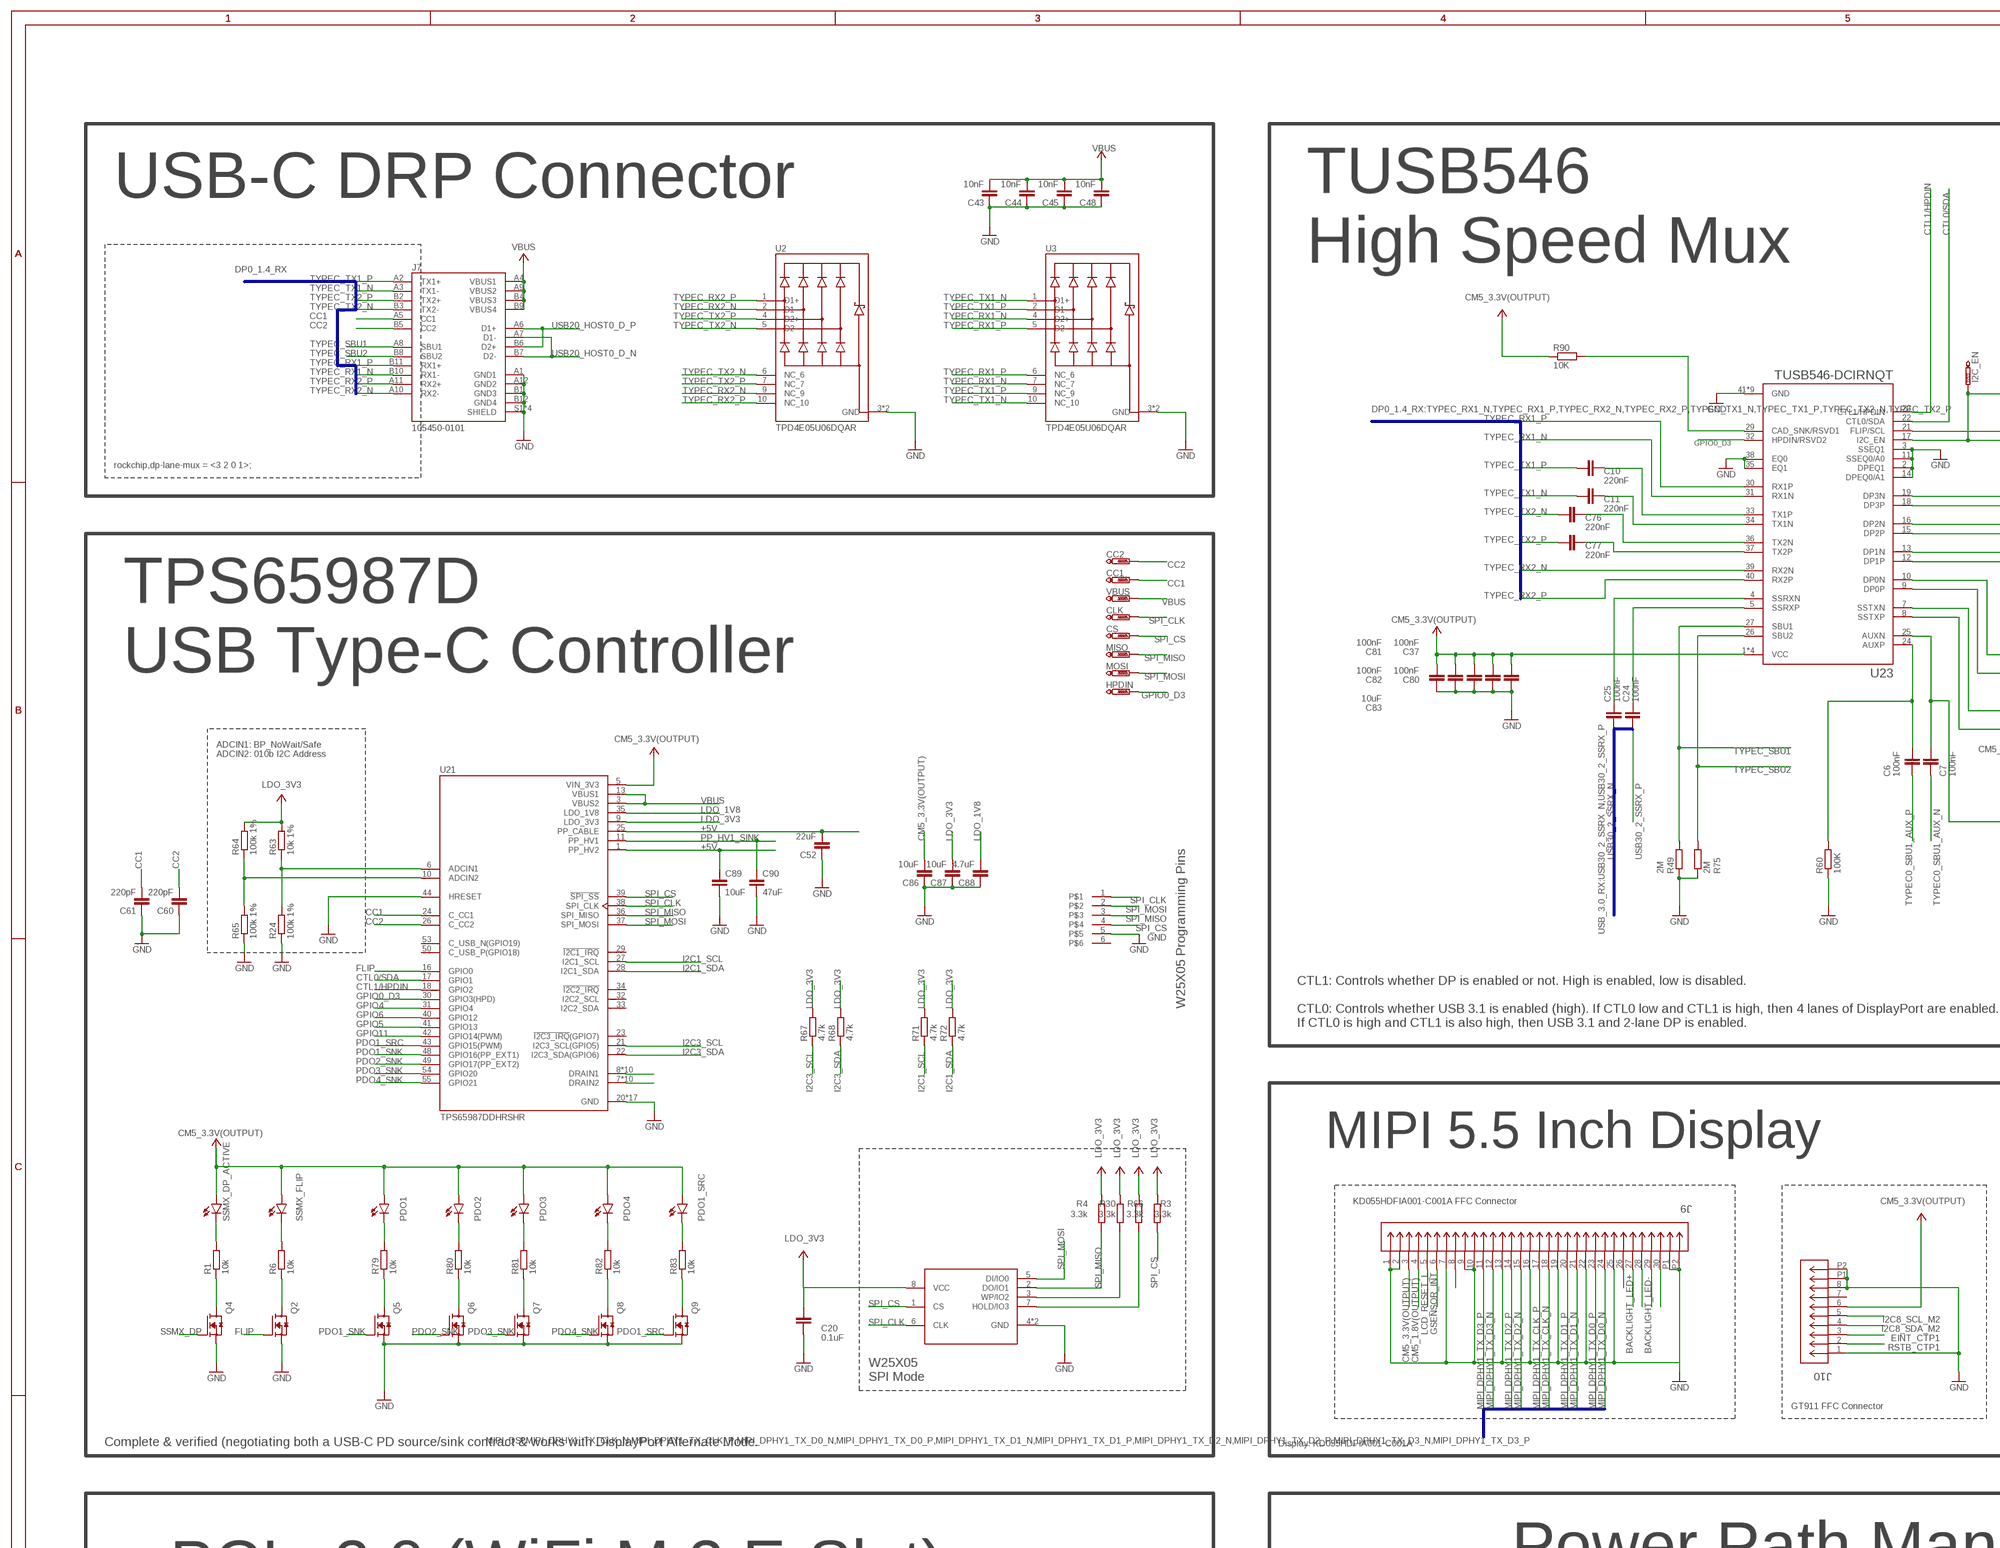
[diagram p6: schematic, sheet 2, part 1 of 4]
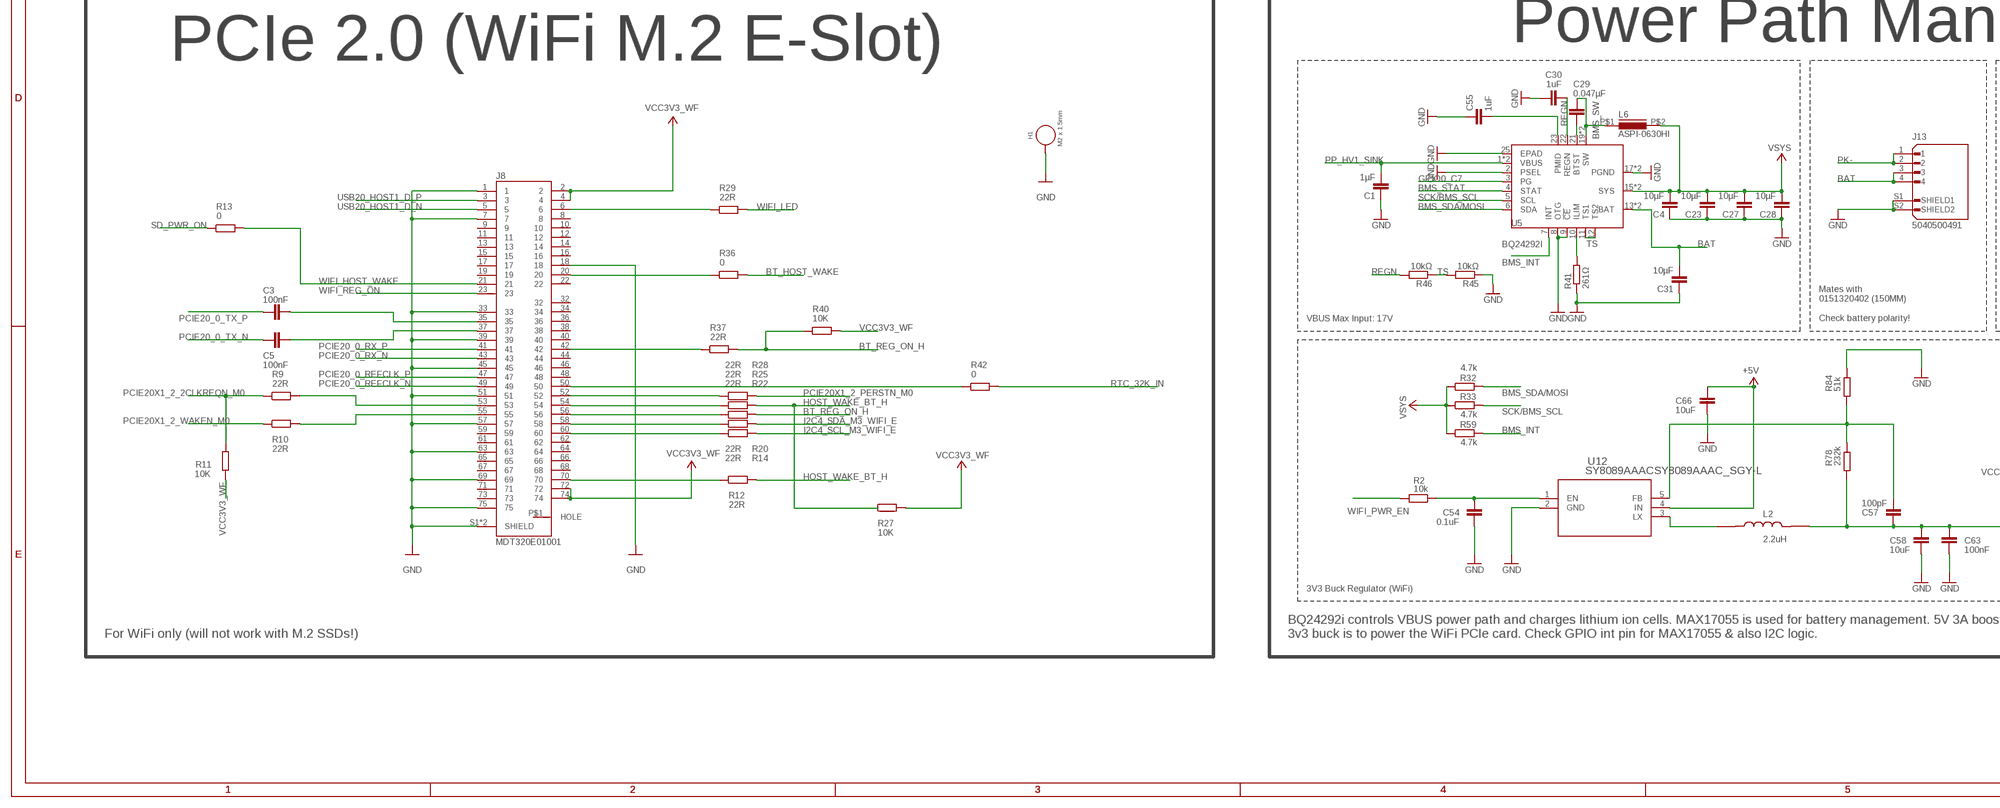
[diagram p7: schematic, sheet 2, part 2 of 4]
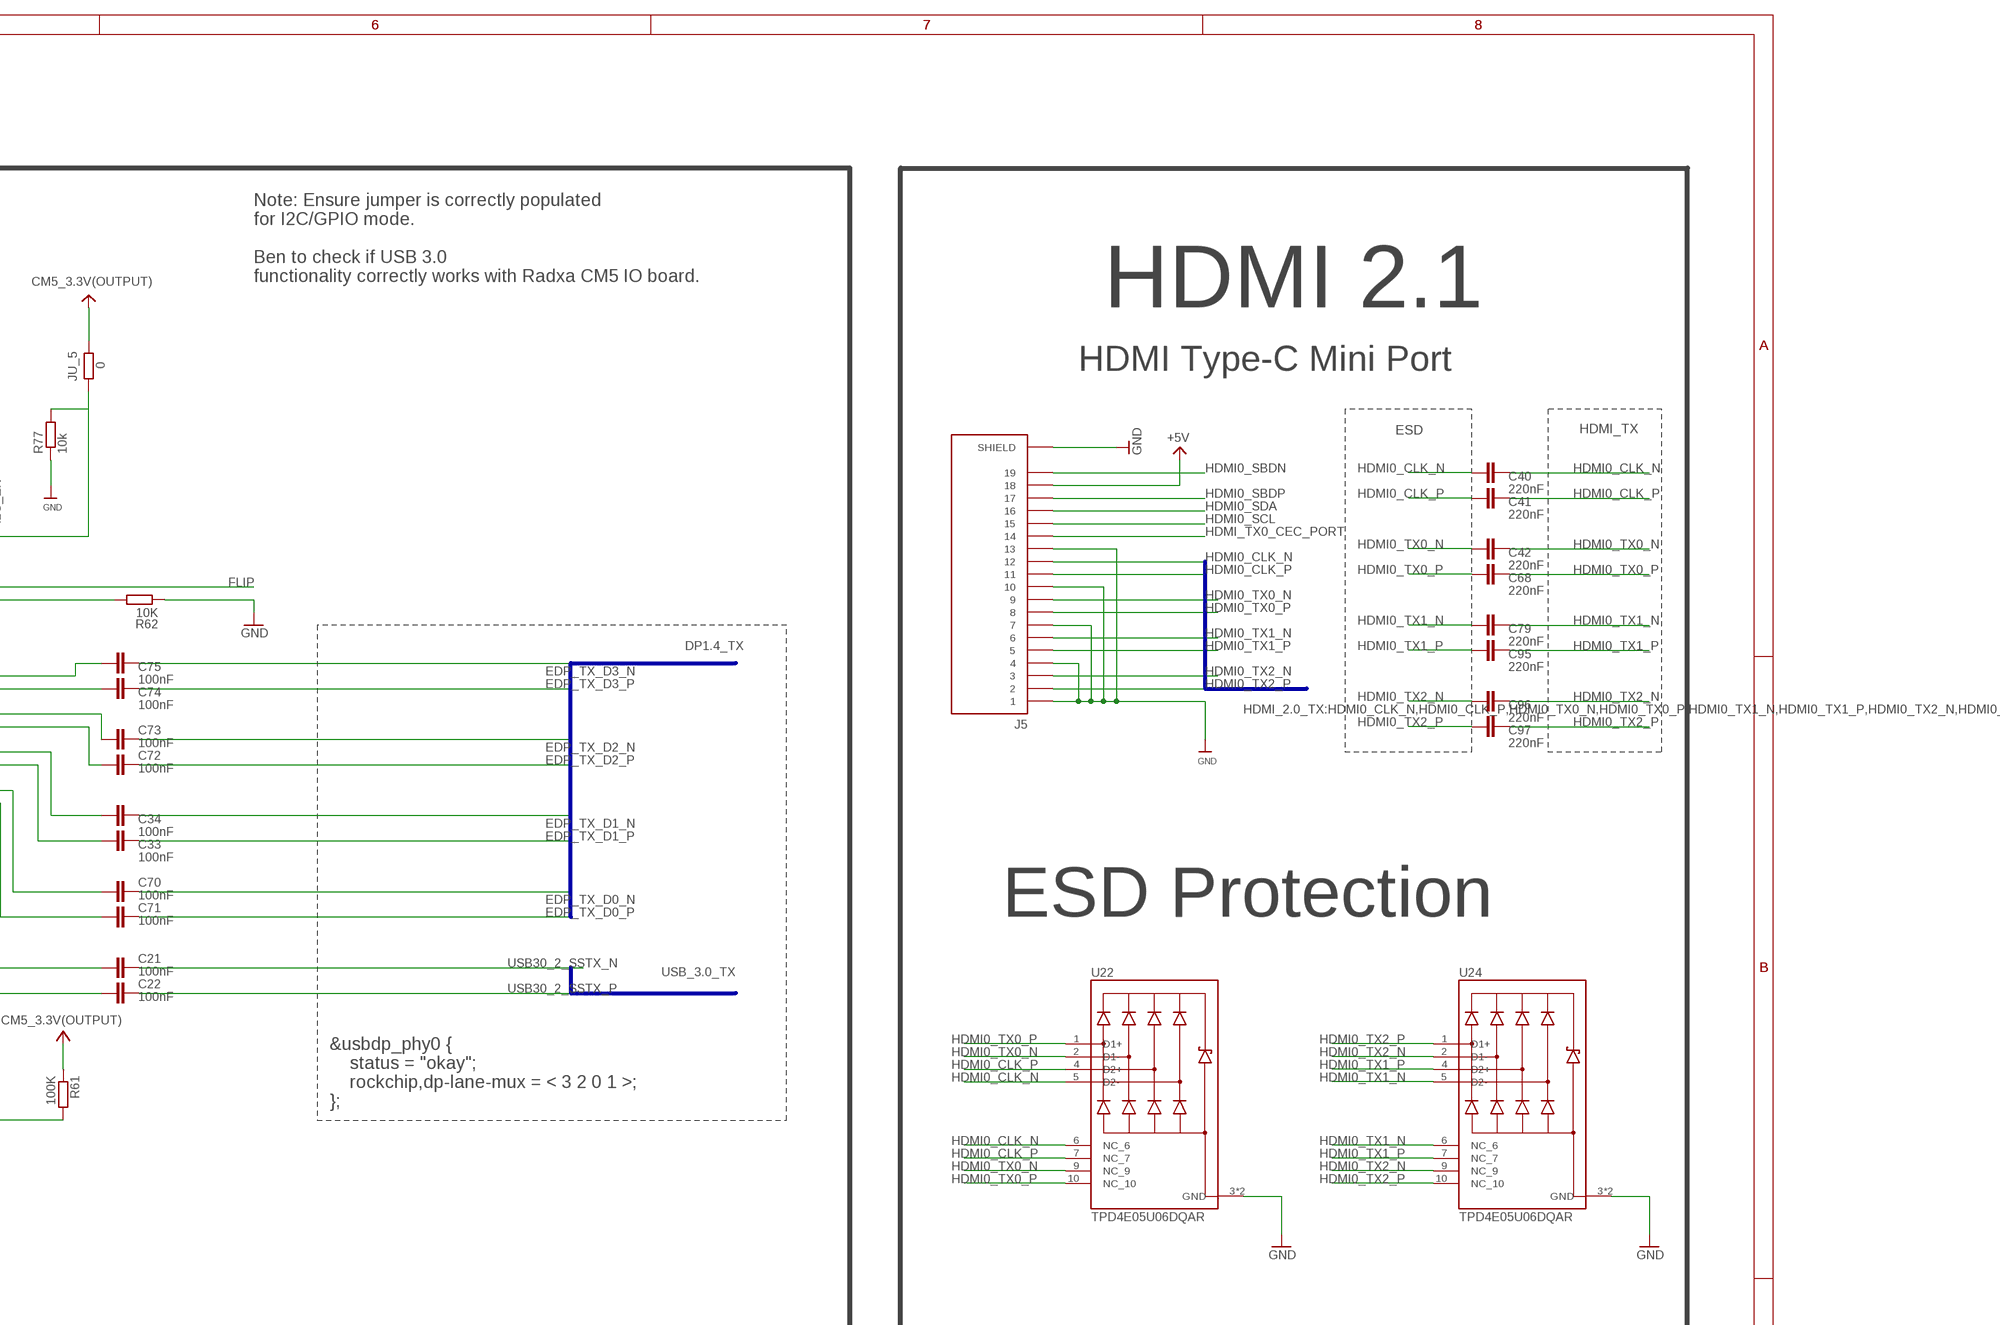
[diagram p8: schematic, sheet 2, part 3 of 4]
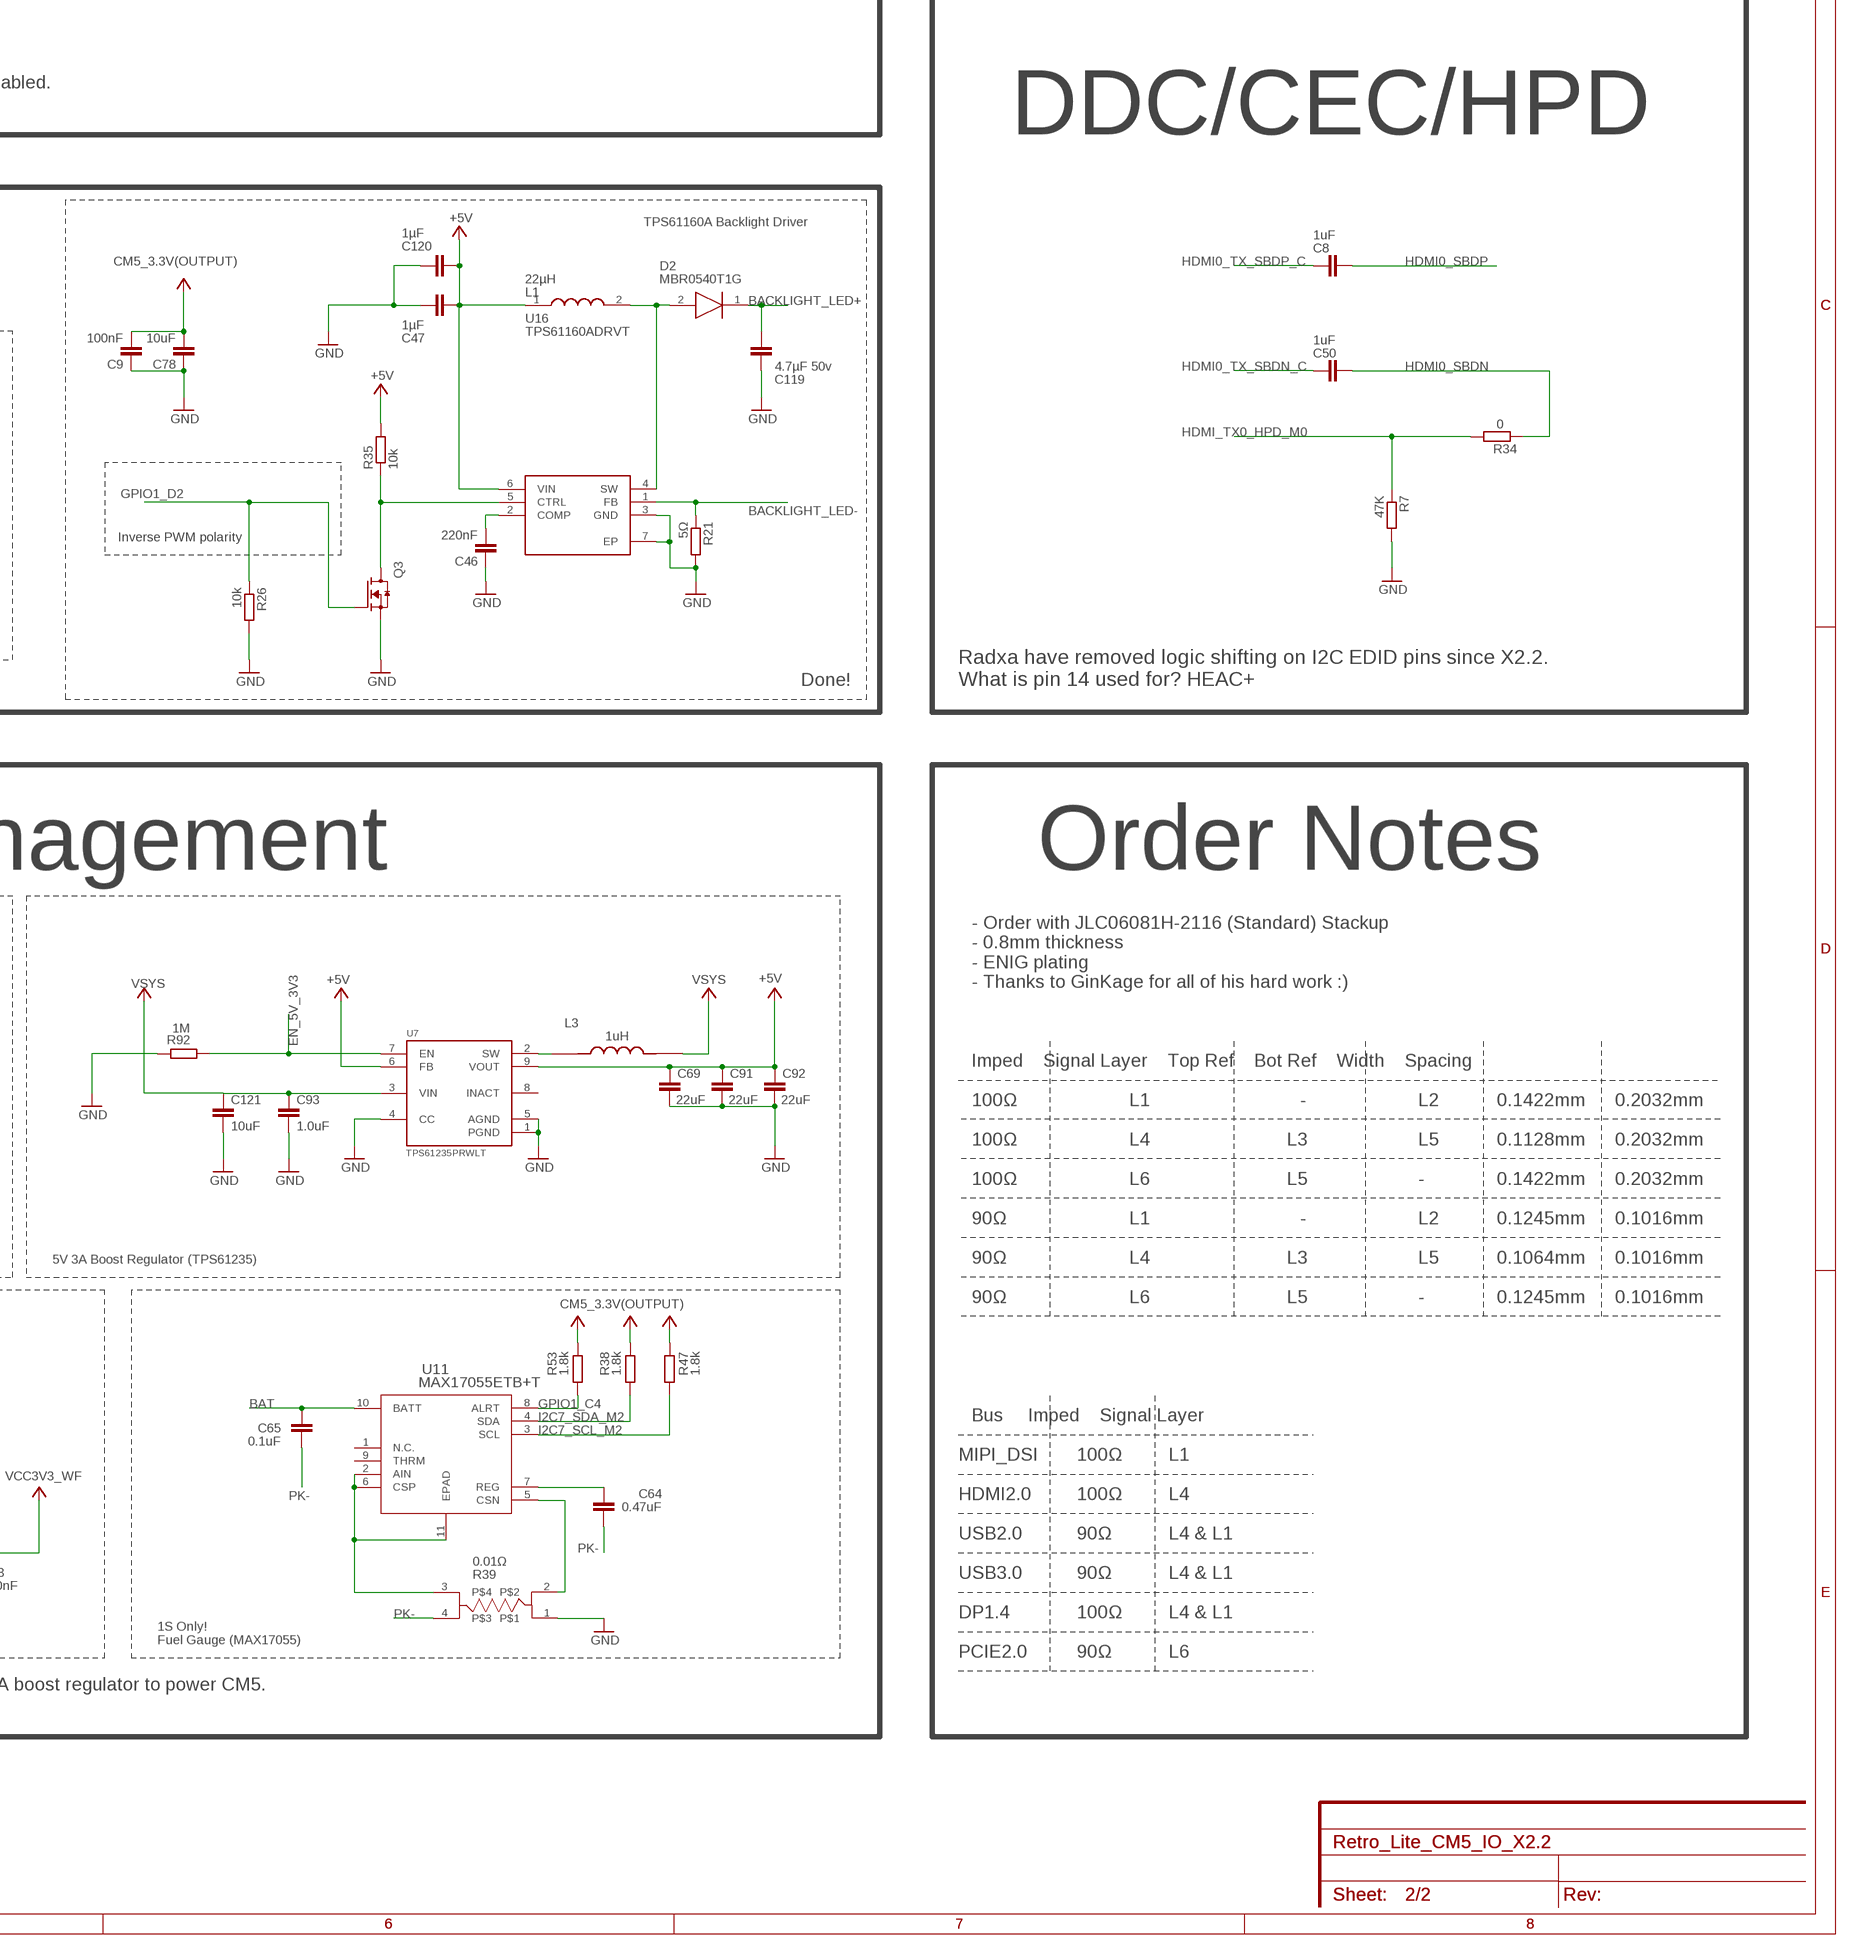
[diagram p9: schematic, sheet 2, part 4 of 4]

### Parts
C1  1µF  C-EUC0805  [C0805]
C3  100nF  C-EUC0402-YVELTAL  [C0402]
C4  10µF  C-EUC0805  [C0805]
C5  100nF  C-EUC0402-YVELTAL  [C0402]
C6  100nF  C-EUC0402  [C0402]
C7  100nF  C-EUC0402  [C0402]
C8  1uF  C-EUC0402  [C0402]
C9  100nF  C-EUC0402-YVELTAL  [C0402]
C10  220nF  C-EUC0402  [C0402]
C11  220nF  C-EUC0402  [C0402]
C20  0.1uF  C-EUC0402  [C0402]
C21  100nF  C-EUC0402  [C0402]
C22  100nF  C-EUC0402  [C0402]
C23  10µF  C-EUC0805  [C0805]
C24  100nF  C-EUC0402  [C0402]
C25  100nF  C-EUC0402  [C0402]
C27  10µF  C-EUC0805  [C0805]
C28  10µF  C-EUC0805  [C0805]
C29  0.047µF  C-EUC0603  [C0603]
C30  1uF  C-EUC0603  [C0603]
C31  10µF  C-EUC0805  [C0805]
C33  100nF  C-EUC0402  [C0402]
C34  100nF  C-EUC0402  [C0402]
C37  100nF  C-EUC0402  [C0402]
C40  220nF  C-EUC0402  [C0402]
C41  220nF  C-EUC0402  [C0402]
C42  220nF  C-EUC0402  [C0402]
C43  10nF  C-EUC0805  [C0805]
C44  10nF  C-EUC0805  [C0805]
C45  10nF  C-EUC0805  [C0805]
C46  220nF  C-EUC0603  [C0603]
C47  1µF  C-EUC0603  [C0603]
C48  10nF  C-EUC0805  [C0805]
C50  1uF  C-EUC0402  [C0402]
C52  22uF  C-EUC0402  [C0402]
C54  0.1uF  C-EUC0402-YVELTAL  [C0402]
C55  1uF  C-EUC0603  [C0603]
C57  100pF  C-EUC0402-YVELTAL  [C0402]
C58  10uF  C-EUC0402-YVELTAL  [C0402]
C60  220pF  C-EUC0402  [C0402]
C61  220pF  C-EUC0402  [C0402]
C63  100nF  C-EUC0402-YVELTAL  [C0402]
C64  0.47uF  C-EUC0402-YVELTAL  [C0402]
C65  0.1uF  C-EUC0402-YVELTAL  [C0402]
C66  10uF  C-EUC0402-YVELTAL  [C0402]
C68  220nF  C-EUC0402  [C0402]
C69  22uF  1.0UF-0805-25V-10%  [0805]
C70  100nF  C-EUC0402  [C0402]
C71  100nF  C-EUC0402  [C0402]
C72  100nF  C-EUC0402  [C0402]
C73  100nF  C-EUC0402  [C0402]
C74  100nF  C-EUC0402  [C0402]
C75  100nF  C-EUC0402  [C0402]
C76  220nF  C-EUC0402  [C0402]
C77  220nF  C-EUC0402  [C0402]
C78  10uF  C-EUC0603  [C0603]
C79  220nF  C-EUC0402  [C0402]
C80  100nF  C-EUC0402  [C0402]
C81  100nF  C-EUC0402  [C0402]
C82  100nF  C-EUC0402  [C0402]
C83  10uF  C-EUC0805  [C0805]
C86  10uF  C-EUC0402  [C0402]
C87  10uF  C-EUC0402  [C0402]
C88  4.7uF  C-EUC0402  [C0402]
C89  10uF  C-EUC0402  [C0402]
C90  47uF  C-EUC0603  [C0603]
C91  22uF  1.0UF-0805-25V-10%  [0805]
C92  22uF  1.0UF-0805-25V-10%  [0805]
C93  1.0uF  1.0UF-0603-16V-10%  [0603]
C95  220nF  C-EUC0402  [C0402]
C96  220nF  C-EUC0402  [C0402]
C97  220nF  C-EUC0402  [C0402]
C119  4.7µF 50v  C-EUC0805  [C0805]
C120  1µF  C-EUC0603  [C0603]
C121  10uF  1.0UF-0603-16V-10%  [0603]
CC1  PTR1TP07R  [TP07R]
CC2  PTR1TP07R  [TP07R]
CLK  PTR1TP07R  [TP07R]
CS  PTR1TP07R  [TP07R]
D2  MBR0540T1G  [SOD3716X135N]
H1  M2 x 1.5mm  WA-SMSI_9774XXX243_9774015243R  [WA-SMSI_9774015243]
HPDIN  PTR1TP07R  [TP07R]
I2C_EN  PTR1TP07R  [TP07R]
J5  685119136923  [WURTH_685119136923]
J7  105450-0101  [MOLEX_105450-0101]
J8  MDT320E01001  [AMPHENOL_MDT320E01001]
J9  5051103091  [CON_5051103091_MOL]
J10  5051100892  [CON_5051100892_MOL]
J13  5040500491  [MOLEX_5040500491]
JU_5  0  R-EU_R0402  [R0402]
L1  22µH  VLCF4020T-220MR56  [VLCF4020_1]
L2  2.2uH  AMDLA4530S-2R2MT  [IND_AMDLA4530S-2R2MT]
L3  1uH  SPM5020T-1R0M  [IND_SPM5020T-1R0M]
L6  ASPI-0630HI  [ASPI-0630HI]
MISO  PTR1TP07R  [TP07R]
MOSI  PTR1TP07R  [TP07R]
PDO1  LEDSML0603  [SML0603]
PDO1_SRC  LEDSML0603  [SML0603]
PDO2  LEDSML0603  [SML0603]
PDO3  LEDSML0603  [SML0603]
PDO4  LEDSML0603  [SML0603]
Q2  AO3400A  [SOT95P280X125-3N]
Q3  AO3400A  [SOT95P280X125-3N]
Q4  AO3400A  [SOT95P280X125-3N]
Q5  AO3400A  [SOT95P280X125-3N]
Q6  AO3400A  [SOT95P280X125-3N]
Q7  AO3400A  [SOT95P280X125-3N]
Q8  AO3400A  [SOT95P280X125-3N]
Q9  AO3400A  [SOT95P280X125-3N]
R1  10k  R-EU_R0402  [R0402]
R2  10k  R-EU_R0402  [R0402]
R3  3.3k  R-EU_R0402  [R0402]
R4  3.3k  R-EU_R0402  [R0402]
R6  10k  R-EU_R0402  [R0402]
R7  47K  R-EU_R0402  [R0402]
R9  22R  R-EU_R0402  [R0402]
R10  22R  R-EU_R0402  [R0402]
R11  10K  R-EU_R0402  [R0402]
R12  22R  R-EU_R0402  [R0402]
R13  0  R-EU_R0402  [R0402]
R14  22R  R-EU_R0402  [R0402]
R20  22R  R-EU_R0402  [R0402]
R21  5Ω  R-EU_R0603  [R0603]
R22  22R  R-EU_R0402  [R0402]
R24  100k 1%  R-EU_R0402  [R0402]
R25  22R  R-EU_R0402  [R0402]
R26  10k  R-EU_R0603  [R0603]
R27  10K  R-EU_R0402  [R0402]
R28  22R  R-EU_R0402  [R0402]
R29  22R  R-EU_R0402  [R0402]
R30  3.3k  R-EU_R0402  [R0402]
R32  4.7k  R-EU_R0402  [R0402]
R33  4.7k  R-EU_R0402  [R0402]
R34  0  R-EU_R0402  [R0402]
R35  10k  R-EU_R0603  [R0603]
R36  0  R-EU_R0402  [R0402]
R37  22R  R-EU_R0402  [R0402]
R38  1.8k  R-EU_R0402  [R0402]
R39  PS0306DRF7T0R01L  [PS0306DRF7T0R01L]
R40  10K  R-EU_R0402  [R0402]
R41  261Ω  R-EU_R0402  [R0402]
R42  0  R-EU_R0402  [R0402]
R45  10kΩ  R-EU_R0402  [R0402]
R46  10kΩ  R-EU_R0603  [R0603]
R47  1.8k  R-EU_R0402  [R0402]
R49  2M  R-EU_R0402  [R0402]
R53  1.8k  R-EU_R0402  [R0402]
R59  4.7k  R-EU_R0402  [R0402]
R60  100K  R-EU_R0402  [R0402]
R61  100K  R-EU_R0402  [R0402]
R62  10K  R-EU_R0402  [R0402]
R63  10k 1%  R-EU_R0402  [R0402]
R64  100k 1%  R-EU_R0402  [R0402]
R65  100k 1%  R-EU_R0402  [R0402]
R66  3.3k  R-EU_R0402  [R0402]
R67  4.7k  R-EU_R0402  [R0402]
R68  4.7k  R-EU_R0402  [R0402]
R71  4.7k  R-EU_R0402  [R0402]
R72  4.7k  R-EU_R0402  [R0402]
R75  2M  R-EU_R0402  [R0402]
R77  10k  R-EU_R0402  [R0402]
R78  232k  R-EU_R0402  [R0402]
R79  10k  R-EU_R0402  [R0402]
R80  10k  R-EU_R0402  [R0402]
R81  10k  R-EU_R0402  [R0402]
R82  10k  R-EU_R0402  [R0402]
R83  10k  R-EU_R0402  [R0402]
R84  51k  R-EU_R0402  [R0402]
R90  10K  R-EU_R0402  [R0402]
R92  1M  R-EU_R0402  [R0402]
SSMX_DP_ACTIVE  LEDSML0603  [SML0603]
SSMX_FLIP_ACTIVE  SSMX_FLIP  LEDSML0603  [SML0603]
U2  TPD4E05U06DQAR  [IC_TPD4E05U06DQAR]
U3  TPD4E05U06DQAR  [IC_TPD4E05U06DQAR]
U4  W25X05CLUXIGTR  [PSON50P300X200X60-9N]
U5  BQ24292I  [QFN50P400X400X100-25N]
U7  TPS61235PRWLT  [CONV_TPS61235PRWLT]
U11  MAX17055ETB+T  [21-100013A_T102A2+1C_MXM]
U12  SY8089AAACSY8089AAAC_SGY-L  [SY8089AAAC_SGY-L]
U16  TPS61160ADRVT  [SON65P200X200X80-7N]
U21  TPS65987DDHRSHR  [IC_TPS65987DDHRSHR]
U22  TPD4E05U06DQAR  [IC_TPD4E05U06DQAR]
U23  TUSB546-DCIRNQT  [QFN40P400X600X80-41N]
U24  TPD4E05U06DQAR  [IC_TPD4E05U06DQAR]
U$7  M.2HOLE  [M.2HOLE]
U$11  6PINEADER  [1MM_PIC-PROGRAMING_HEADER]
VBUS  PTR1TP07R  [TP07R]

### Nets
+5V: C47.1 C52.2 C66.1 C69.1 C89.1 C91.1 C92.1 C120.1 J5.18 L1.1 R35.2 U7.6(FB) U7.9(VOUT) U12.4(IN) U16.6(VIN) U21.1(PP_HV2) U21.25(PP_CABLE) ; supply symbol labelled VSYS, VDDIO ; also sheet 1
BACKLIGHT_LED+: C119.1 D2.1(K) J9.27
BACKLIGHT_LED-: J9.29 R21.1 U16.1(FB)
BAT: C31.2 C65.1 J13.3 J13.4 U5.13(BAT) U5.14(BAT) U11.10(BATT) ; also sheet 1
BMS_INT: R59.2 U5.7(INT) ; also sheet 1
BMS_SDA/MOSI: R32.2 U5.6(SDA) ; also sheet 1
BMS_STAT: U5.4(STAT) ; also sheet 1
BMS_SW: C29.1 L6.P$1 U5.19(SW) U5.20(SW)
BT_HOST_WAKE: R36.2 ; also sheet 1
BT_REG_ON_H: R22.2 R37.2 R40.1 ; also sheet 1
CC1: C61.2 CC1.TP J7.A5(CC1) U21.24(C_CC1)
CC2: C60.2 CC2.TP J7.B5(CC2) U21.26(C_CC2)
CM5_1.8V(OUTPUT): J9.4 ; also sheet 1
CM5_3.3V(OUTPUT): C9.2 C37.2 C78.2 C80.2 C81.2 C82.2 C83.2 C86.2 J9.3 J10.6 JU_5.2 PDO1.A PDO1_SRC.A PDO2.A PDO3.A PDO4.A R38.1 R47.1 R53.1 R61.1 R90.1 SSMX_DP_ACTIVE.A SSMX_FLIP_ACTIVE.A U21.5(VIN_3V3) U23.1(VCC) U23.6(VCC) U23.20(VCC) U23.28(VCC) ; supply symbol labelled +5V, VSYS, VCC, VDDIO ; also sheet 1
CTL0/SDA: U21.17(GPIO1) U23.22(CTL0/SDA)
CTL1/HPDIN: U21.18(GPIO2) U23.23(CTL1/HPDIN)
EDP_TX_D0_N [eDP 1st Layer]: C70.1 C70.2 U23.10(DP0N) ; also sheet 1
EDP_TX_D0_P [eDP 1st Layer]: C71.1 C71.2 U23.9(DP0P) ; also sheet 1
EDP_TX_D1_N [eDP 1st Layer]: C34.1 C34.2 U23.13(DP1N) ; also sheet 1
EDP_TX_D1_P [eDP 1st Layer]: C33.1 C33.2 U23.12(DP1P) ; also sheet 1
EDP_TX_D2_N [eDP 1st Layer]: C73.1 C73.2 U23.16(DP2N) ; also sheet 1
EDP_TX_D2_P [eDP 1st Layer]: C72.1 C72.2 U23.15(DP2P) ; also sheet 1
EDP_TX_D3_N [eDP 1st Layer]: C75.1 C75.2 U23.19(DP3N) ; also sheet 1
EDP_TX_D3_P [eDP 1st Layer]: C74.1 C74.2 U23.18(DP3P) ; also sheet 1
EINT_CTP1: J10.3 ; also sheet 1
EN_5V_3V3: R92.2 U7.7(EN) ; also sheet 1
FLIP: Q2.1(G) U21.16(GPIO0) U23.21(FLIP/SCL)
GND: C1.1 C4.1 C9.1 C20.1 C23.1 C27.1 C28.1 C30.1 C31.1 C37.1 C43.1 C44.1 C45.1 C46.1 C47.2 C48.1 C52.1 C54.2 C55.1 C58.2 C60.1 C61.1 C63.2 C66.2 C69.2 C78.1 C80.1 C81.1 C82.1 C83.1 C86.1 C87.1 C88.1 C89.2 C90.2 C91.2 C92.2 C93.2 C119.2 C120.2 C121.2 H1.1 J5.1 J5.4 J5.7 J5.10 J5.13 J5.S1(SHIELD) J5.S2(SHIELD) J5.S3(SHIELD) J5.S4(SHIELD) J7.A1(GND1) J7.A12(GND2) J7.B1(GND3) J7.B12(GND4) J7.S1(SHIELD) J7.S2(SHIELD) J7.S3(SHIELD) J7.S4(SHIELD) J8.1 J8.7 J8.18 J8.33 J8.39 J8.45 J8.51 J8.57 J8.63 J8.69 J8.75 J8.S1(SHIELD) J8.S2(SHIELD) J9.1 J9.2 J9.7 J9.9 J9.10 J9.13 J9.16 J9.19 J9.22 J9.25 J9.P1 J9.P2 J10.1 J10.8 J10.P1 J10.P2 J13.S1(SHIELD1) J13.S2(SHIELD2) Q2.2(S) Q3.2(S) Q4.2(S) Q5.2(S) Q6.2(S) Q7.2(S) Q8.2(S) Q9.2(S) R7.2 R21.2 R24.1 R26.2 R39.1 R41.1 R45.1 R49.1 R60.1 R62.1 R65.1 R75.1 R77.1 R84.1 R92.1 U2.3(GND) U2.8(GND) U3.3(GND) U3.8(GND) U4.4(GND) U4.9(GND) U5.2(PSEL) U5.8(OTG) U5.9(!CE) U5.17(PGND) U5.18(PGND) U5.25(EPAD) U7.1(PGND) U7.4(CC) U7.5(AGND) U12.2(GND) U16.3(GND) U16.7(EP) U21.20(GND) U21.44(HRESET) U21.45(GND) U21.46(GND) U21.47(GND) U21.51(GND) U21.59(GND) U21.59_1(GND) U21.59_2(GND) U21.59_3(GND) U21.59_4(GND) U21.59_5(GND) U21.59_6(GND) U21.59_7(GND) U21.59_8(GND) U21.59_9(GND) U21.59_10(GND) U21.59_11(GND) U22.3(GND) U22.8(GND) U23.2(DPEQ1) U23.3(SSEQ1) U23.11(SSEQ0/A0) U23.14(DPEQ0/A1) U23.35(EQ1) U23.38(EQ0) U23.41(GND) U23.42(GND) U23.43(GND) U23.44(GND) U23.45(GND) U23.46(GND) U23.47(GND) U23.48(GND) U23.49(GND) U24.3(GND) U24.8(GND) U$11.5 ; also sheet 1
GPIO0_C7: U5.3(PG) ; also sheet 1
GPIO0_D3: HPDIN.TP U21.30(GPIO3(HPD)) U23.32(HPDIN/RSVD2) ; also sheet 1
GPIO1_C4: R53.2 U11.8(ALRT) ; also sheet 1
GPIO1_D2: Q3.1(G) R26.1 ; also sheet 1
GPIO4: U21.31(GPIO4)
GPIO5: U21.41(GPIO13)
GPIO6: U21.40(GPIO12)
GPIO11: U21.42(GPIO14(PWM))
GSENSOR_INT: J9.6 ; also sheet 1
HDMI0_CLK_N [HDMI 4th Layer]: C40.1 C40.2 J5.12 U22.5(D2-) U22.6(NC_6) ; also sheet 1
HDMI0_CLK_P [HDMI 4th Layer]: C41.1 C41.2 J5.11 U22.4(D2+) U22.7(NC_7) ; also sheet 1
HDMI0_SBDN: C50.2 J5.19 R34.1
HDMI0_SBDP: C8.2 J5.17
HDMI0_SCL: J5.15 ; also sheet 1
HDMI0_SDA: J5.16 ; also sheet 1
HDMI0_TX0_N [HDMI 4th Layer]: C42.1 C42.2 J5.9 U22.2(D1-) U22.9(NC_9) ; also sheet 1
HDMI0_TX0_P [HDMI 4th Layer]: C68.1 C68.2 J5.8 U22.1(D1+) U22.10(NC_10) ; also sheet 1
HDMI0_TX1_N [HDMI 4th Layer]: C79.1 C79.2 J5.6 U24.5(D2-) U24.6(NC_6) ; also sheet 1
HDMI0_TX1_P [HDMI 4th Layer]: C95.1 C95.2 J5.5 U24.4(D2+) U24.7(NC_7) ; also sheet 1
HDMI0_TX2_N [HDMI 4th Layer]: C96.1 C96.2 J5.3 U24.2(D1-) U24.9(NC_9) ; also sheet 1
HDMI0_TX2_P [HDMI 4th Layer]: C97.1 C97.2 J5.2 U24.1(D1+) U24.10(NC_10) ; also sheet 1
HDMI0_TX_SBDN_C: C50.1 ; also sheet 1
HDMI0_TX_SBDP_C: C8.1 ; also sheet 1
HDMI_TX0_CEC_PORT: J5.14 ; also sheet 1
HDMI_TX0_HPD_M0: R7.1 R34.2 ; also sheet 1
HOST_WAKE_BT_H: R12.2 R25.2 R27.1 ; also sheet 1
I2C1_SCL: R71.1 U21.27(I2C1_SCL)
I2C1_SDA: R72.1 U21.28(I2C1_SDA)
I2C3_SCL: R67.1 U21.21(I2C3_SCL(GPIO5))
I2C3_SDA: R68.1 U21.22(I2C3_SDA(GPIO6))
I2C4_SCL_M3_WIFI_E: R14.2 ; also sheet 1
I2C4_SDA_M3_WIFI_E: R20.2 ; also sheet 1
I2C7_SCL_M2: R47.2 U11.3(SCL) ; also sheet 1
I2C7_SDA_M2: R38.2 U11.4(SDA) ; also sheet 1
I2C8_SCL_M2: J10.5 ; also sheet 1
I2C8_SDA_M2: J10.4 ; also sheet 1
LCD_RESET_L: J9.5 ; also sheet 1
LDO_1V8: C88.2 U21.35(LDO_1V8)
LDO_3V3: C20.2 C87.2 R3.2 R4.2 R30.2 R63.2 R64.2 R66.2 R67.2 R68.2 R71.2 R72.2 U4.8(VCC) U21.9(LDO_3V3) ; supply symbol labelled VCC
MIPI_DPHY1_TX_CLK_N [MIPI]: J9.18 ; also sheet 1
MIPI_DPHY1_TX_CLK_P [MIPI]: J9.17 ; also sheet 1
MIPI_DPHY1_TX_D0_N [MIPI]: J9.24 ; also sheet 1
MIPI_DPHY1_TX_D0_P [MIPI]: J9.23 ; also sheet 1
MIPI_DPHY1_TX_D1_N [MIPI]: J9.21 ; also sheet 1
MIPI_DPHY1_TX_D1_P [MIPI]: J9.20 ; also sheet 1
MIPI_DPHY1_TX_D2_N [MIPI]: J9.15 ; also sheet 1
MIPI_DPHY1_TX_D2_P [MIPI]: J9.14 ; also sheet 1
MIPI_DPHY1_TX_D3_N [MIPI]: J9.12 ; also sheet 1
MIPI_DPHY1_TX_D3_P [MIPI]: J9.11 ; also sheet 1
N$1: J8.20 R36.1
N$2: PDO1.C R79.2
N$3: C57.2 R78.1 R84.2 U12.5(FB)
N$4: R30.1 U4.3(WP/IO2)
N$5: R66.1 U4.7(HOLD/IO3)
N$6: PDO2.C R80.2
N$7: R1.2 SSMX_DP_ACTIVE.C
N$8: R6.2 SSMX_FLIP_ACTIVE.C
N$9: Q4.3(D) R1.1
N$11: Q2.3(D) R6.1
N$12: PDO3.C R81.2
N$12_N: C5.1 J8.37
N$12_P: C3.1 J8.35
N$13: J9.8
N$14: C46.2 U16.2(COMP)
N$15: L3.1 U7.2(SW)
N$16: J9.26
N$17: J9.28
N$18: J9.30
N$19: PDO4.C R82.2
N$20: J8.53 R9.2
N$21: J8.55 R10.2
N$22: D2.2(A) L1.2 U16.4(SW)
N$23: Q3.3(D) R35.1 U16.5(CTRL)
N$24: J8.70 R12.1
N$25: J8.6 R29.1
N$26: J8.52 R28.1
N$27: J8.54 R25.1
N$28: J8.56 R22.1
N$29: C55.2 U5.23(PMID)
N$30: C64.1 U11.7(REG)
N$31: C54.1 R2.1 U12.1(EN)
N$32: R39.2 U11.5(CSN)
N$33: C29.2 U5.21(BTST)
N$34: R41.2 U5.10(ILIM)
N$36: J8.58 R20.1
N$37: R24.2 R63.1 U21.6(ADCIN1)
N$38: J8.60 R14.1
N$40: J8.42 R37.1
N$41: R39.3 U11.2(AIN) U11.6(CSP) U11.11(EPAD)
N$45: U21.8(DRAIN1) U21.15(DRAIN1) U21.19(DRAIN1) U21.58(DRAIN1) U21.58_1(DRAIN1) U21.58_2(DRAIN1) U21.58_3(DRAIN1) U21.58_4(DRAIN1) U21.58_5(DRAIN1) U21.58_6(DRAIN1)
N$46: U21.7(DRAIN2) U21.52(DRAIN2) U21.56(DRAIN2) U21.57(DRAIN2) U21.57_1(DRAIN2) U21.57_2(DRAIN2) U21.57_3(DRAIN2) U21.57_4(DRAIN2) U21.57_5(DRAIN2) U21.57_6(DRAIN2)
N$47: R64.1 R65.2 U21.10(ADCIN2)
N$48: PDO1_SRC.C R83.2
N$50: Q9.3(D) R83.1
N$52: Q8.3(D) R82.1
N$53: Q7.3(D) R81.1
N$54_N: C7.2 R61.2 U23.25(AUXN)
N$55: Q5.3(D) R79.1
N$56: I2C_EN.TP JU_5.1 R62.2 R77.2 U23.17(I2C_EN)
N$57: Q6.3(D) R80.1
N$58: L2.1 U12.3(LX)
N$62: R90.2 U23.29(CAD_SNK/RSVD1)
N$63: J8.50 R42.1
PCIE20_0_REFCLK_N [PCIE2.0]: J8.49 ; also sheet 1
PCIE20_0_REFCLK_P [PCIE2.0]: J8.47 ; also sheet 1
PCIE20_0_RX_N [PCIE2.0]: J8.43 ; also sheet 1
PCIE20_0_RX_P [PCIE2.0]: J8.41 ; also sheet 1
PCIE20_0_TX_N [PCIE2.0]: C5.2 ; also sheet 1
PCIE20_0_TX_P [PCIE2.0]: C3.2 ; also sheet 1
PCIE20X1_2_2CLKREQN_M0: R9.1 R11.2 ; also sheet 1
PCIE20X1_2_PERSTN_M0: R28.2 ; also sheet 1
PCIE20X1_2_WAKEN_M0: R10.1 ; also sheet 1
PDO1_SNK: Q5.1(G) U21.48(GPIO16(PP_EXT1))
PDO1_SRC: Q9.1(G) U21.43(GPIO15(PWM))
PDO2_SNK: Q6.1(G) U21.49(GPIO17(PP_EXT2))
PDO3_SNK: Q7.1(G) U21.54(GPIO20)
PDO4_SNK: Q8.1(G) U21.55(GPIO21)
PK-: C64.2 C65.2 J13.1 J13.2 R39.4
PP_HV1_SINK: C1.2 C90.1 U5.1(VBUS) U5.24(VBUS) U21.11(PP_HV1)
REGN: C30.2 R46.2 U5.22(REGN)
RSTB_CTP1: J10.2 ; also sheet 1
RTC_32K_IN: R42.2 ; also sheet 1
SCK/BMS_SCL: R33.2 U5.5(SCL) ; also sheet 1
SD_PWR_ON [eMMC HS400]: R13.1 ; also sheet 1
SPI_CLK: CLK.TP U4.6(CLK) U21.38(SPI_CLK) U$11.1
SPI_CS: CS.TP R3.1 U4.1(CS) U21.39(!SPI_SS) U$11.4
SPI_MISO: MISO.TP R4.1 U4.2(DO/IO1) U21.36(SPI_MISO) U$11.3
SPI_MOSI: MOSI.TP U4.5(DI/IO0) U21.37(SPI_MOSI) U$11.2
SSMX_DP: Q4.1(G)
TS: R45.2 R46.1 U5.11(TS1) U5.12(TS2)
TYPEC0_SBU1_AUX_N: C7.1 ; also sheet 1
TYPEC0_SBU1_AUX_P: C6.1 C6.2 R60.2 U23.24(AUXP) ; also sheet 1
TYPEC_RX1_N: J7.B10(RX1-) U3.4(D2+) U3.7(NC_7) U23.31(RX1N)
TYPEC_RX1_P: J7.B11(RX1+) U3.5(D2-) U3.6(NC_6) U23.30(RX1P)
TYPEC_RX2_N: J7.A10(RX2-) U2.2(D1-) U2.9(NC_9) U23.39(RX2N)
TYPEC_RX2_P: J7.A11(RX2+) U2.1(D1+) U2.10(NC_10) U23.40(RX2P)
TYPEC_SBU1: J7.A8(SBU1) R49.2 U23.27(SBU1) ; also sheet 1
TYPEC_SBU2: J7.B8(SBU2) R75.2 U23.26(SBU2) ; also sheet 1
TYPEC_TX1_N: C11.1 C11.2 J7.A3(TX1-) U3.1(D1+) U3.10(NC_10) U23.34(TX1N)
TYPEC_TX1_P: C10.1 C10.2 J7.A2(TX1+) U3.2(D1-) U3.9(NC_9) U23.33(TX1P)
TYPEC_TX2_N: C76.1 C76.2 J7.B3(TX2-) U2.5(D2-) U2.6(NC_6) U23.36(TX2N)
TYPEC_TX2_P: C77.1 C77.2 J7.B2(TX2+) U2.4(D2+) U2.7(NC_7) U23.37(TX2P)
USB20_HOST0_D_N [USB2.0 4th Layer]: J7.A7(D1-) J7.B7(D2-) ; also sheet 1
USB20_HOST0_D_P [USB2.0 4th Layer]: J7.A6(D1+) J7.B6(D2+) ; also sheet 1
USB20_HOST1_D_N [USB2.0]: J8.5 ; also sheet 1
USB20_HOST1_D_P [USB2.0]: J8.3 ; also sheet 1
USB30_2_SSRX_N [USB3.0]: C25.1 C25.2 U23.4(SSRXN) ; also sheet 1
USB30_2_SSRX_P [USB3.0]: C24.1 C24.2 U23.5(SSRXP) ; also sheet 1
USB30_2_SSTX_N [USB3.0]: C21.1 C21.2 U23.7(SSTXN) ; also sheet 1
USB30_2_SSTX_P [USB3.0]: C22.1 C22.2 U23.8(SSTXP) ; also sheet 1
VBUS: C43.2 C44.2 C45.2 C48.2 J7.A4(VBUS1) J7.A9(VBUS2) J7.B4(VBUS3) J7.B9(VBUS4) U21.3(VBUS2) U21.13(VBUS1) VBUS.TP ; supply symbol labelled VCC
VCC3V3_WF: C57.1 C58.1 C63.1 J8.2 J8.4 J8.72 J8.74 L2.2 R11.1 R27.2 R40.2 R78.2 ; supply symbol labelled VSYS, VCC ; also sheet 1
VSYS: C4.2 C23.2 C27.2 C28.2 C93.1 C121.1 L3.2 L6.P$2 R32.1 R33.1 R59.1 U5.15(SYS) U5.16(SYS) U7.3(VIN) ; also sheet 1
WIFI_HOST_WAKE: J8.21 R13.2
WIFI_LED: R29.2 ; also sheet 1
WIFI_PWR_EN: R2.2 ; also sheet 1
WIFI_REG_ON: J8.23 ; also sheet 1
Unconnected: J8.8 J8.9 J8.10 J8.11 J8.12 J8.13 J8.14 J8.15 J8.16 J8.17 J8.19 J8.22 J8.32 J8.34 J8.36 J8.38 J8.40 J8.44 J8.46 J8.48 J8.59 J8.61 J8.62 J8.64 J8.65 J8.66 J8.67 J8.68 J8.71 J8.73 J10.7 U7.8(INACT) U11.1(N.C.) U11.9(THRM) U21.23(!I2C3_IRQ!(GPIO7)) U21.29(!I2C1_IRQ) U21.32(I2C2_SCL) U21.33(I2C2_SDA) U21.34(!I2C2_IRQ) U21.50(C_USB_P(GPIO18)) U21.53(C_USB_N(GPIO19)) U$7.P$1(HOLE) U$11.6

### Buses
DP0_1.4:TYPEC_RX1_N,TYPEC_RX1_P,TYPEC_RX2_N,TYPEC_RX2_P,TYPEC_TX1_N,TYPEC_TX1_P,TYPEC_TX2_N,TYPEC_TX2_P
MIPI_DSI:MIPI_DPHY1_TX_CLK_N,MIPI_DPHY1_TX_CLK_P,MIPI_DPHY1_TX_D0_N,MIPI_DPHY1_TX_D0_P,MIPI_DPHY1_TX_D1_N,MIPI_DPHY1_TX_D1_P,MIPI_DPHY1_TX_D2_N,MIPI_DPHY1_TX_D2_P,MIPI_DPHY1_TX_D3_N,MIPI_DPHY1_TX_D3_P
EDP_TX_D0_N,EDP_TX_D0_P,EDP_TX_D1_N,EDP_TX_D1_P,EDP_TX_D2_N,EDP_TX_D2_P,EDP_TX_D3_N,EDP_TX_D3_P
DP0_1.4_RX:TYPEC_RX1_N,TYPEC_RX1_P,TYPEC_RX2_N,TYPEC_RX2_P,TYPEC_TX1_N,TYPEC_TX1_P,TYPEC_TX2_N,TYPEC_TX2_P
USB3.0_RX:USB30_2_SSTX_N,USB30_2_SSTX_P
HDMI_2.0_TX:HDMI0_CLK_N,HDMI0_CLK_P,HDMI0_TX0_N,HDMI0_TX0_P,HDMI0_TX1_N,HDMI0_TX1_P,HDMI0_TX2_N,HDMI0_TX2_P
USB_3.0_RX:USB30_2_SSRX_N,USB30_2_SSRX_P

### Notes on the sheet
- USB-C DRP Connector
- Note: Ensure jumper is correctly populated
  for I2C/GPIO mode.
  
  Ben to check if USB 3.0 
  functionality correctly works with Radxa CM5 IO board.
- HDMI 2.1
- TUSB546
  High Speed Mux
- DP0_1.4_RX | HDMI Type-C Mini Port
- ESD | HDMI_TX
- rockchip,dp-lane-mux = <3 2 0 1>;
- DP1.4_TX
- TPS65987D
  USB Type-C Controller
- ESD Protection
- USB_3.0_TX
- ADCIN1: BP_NoWait/Safe
- ADCIN2: 010b I2C Address
- &usbdp_phy0 {
      status = "okay";
      rockchip,dp-lane-mux = < 3 2 0 1 >;
  };
- W25X05 Programming Pins
- CTL1: Controls whether DP is enabled or not. High is enabled, low is disabled. 
  
  CTL0: Controls whether USB 3.1 is enabled (high). If CTL0 low and CTL1 is high, then 4 lanes of DisplayPort are enabled. 
  If CTL0 is high and CTL1 is also high, then USB 3.1 and 2-lane DP is enabled.
- DDC/CEC/HPD
- TPS61160A Backlight Driver
- MIPI 5.5 Inch Display
- KD055HDFIA001-C001A FFC Connector
- Inverse PWM polarity
- W25X05 
  SPI Mode
- GT911 FFC Connector
- Done!
- Radxa have removed logic shifting on I2C EDID pins since X2.2. 
  What is pin 14 used for? HEAC+
- Complete & verified (negotiating both a USB-C PD source/sink contract & works with DisplayPort Alternate Mode. | Display: KD055HDFIA001-C001A
- Power Path Management | Order Notes
- PCIe 2.0 (WiFi M.2 E-Slot)
- - Order with JLC06081H-2116 (Standard) Stackup
  - 0.8mm thickness
  - ENIG plating
  - Thanks to GinKage for all of his hard work :)
- Imped    Signal Layer    Top Ref    Bot Ref    Width    Spacing
- 100Ω | L1 | - | L2 | 0.1422mm | 0.2032mm
- 100Ω | L4 | L3 | L5 | 0.1128mm | 0.2032mm
- 100Ω | L6 | L5 | - | 0.1422mm | 0.2032mm
- 90Ω | L1 | - | L2 | 0.1245mm | 0.1016mm
- 100nF
- VBUS Max Input: 17V
- Mates with
  0151320402 (150MM)
  
  Check battery polarity!
- 5V 3A Boost Regulator (TPS61235) | 90Ω | L4 | L3 | L5 | 0.1064mm | 0.1016mm
- 90Ω | L6 | L5 | - | 0.1245mm | 0.1016mm
- 100nF
- Bus     Imped    Signal Layer
- MIPI_DSI | 100Ω | L1
- HDMI2.0 | 100Ω | L4
- USB2.0 | 90Ω | L4 & L1
- 0.01Ω
- R39 | USB3.0 | 90Ω | L4 & L1
- DP1.4 | 100Ω | L4 & L1
- 3V3 Buck Regulator (WiFi)
- 1S Only!
  Fuel Gauge (MAX17055)
- PCIE2.0 | 90Ω | L6
- For WiFi only (will not work with M.2 SSDs!)
- BQ24292i controls VBUS power path and charges lithium ion cells. MAX17055 is used for battery management. 5V 3A boost regulator to power CM5. 
  3v3 buck is to power the WiFi PCIe card. Check GPIO int pin for MAX17055 & also I2C logic.